# Altium project BISS_EB.PrjPcb
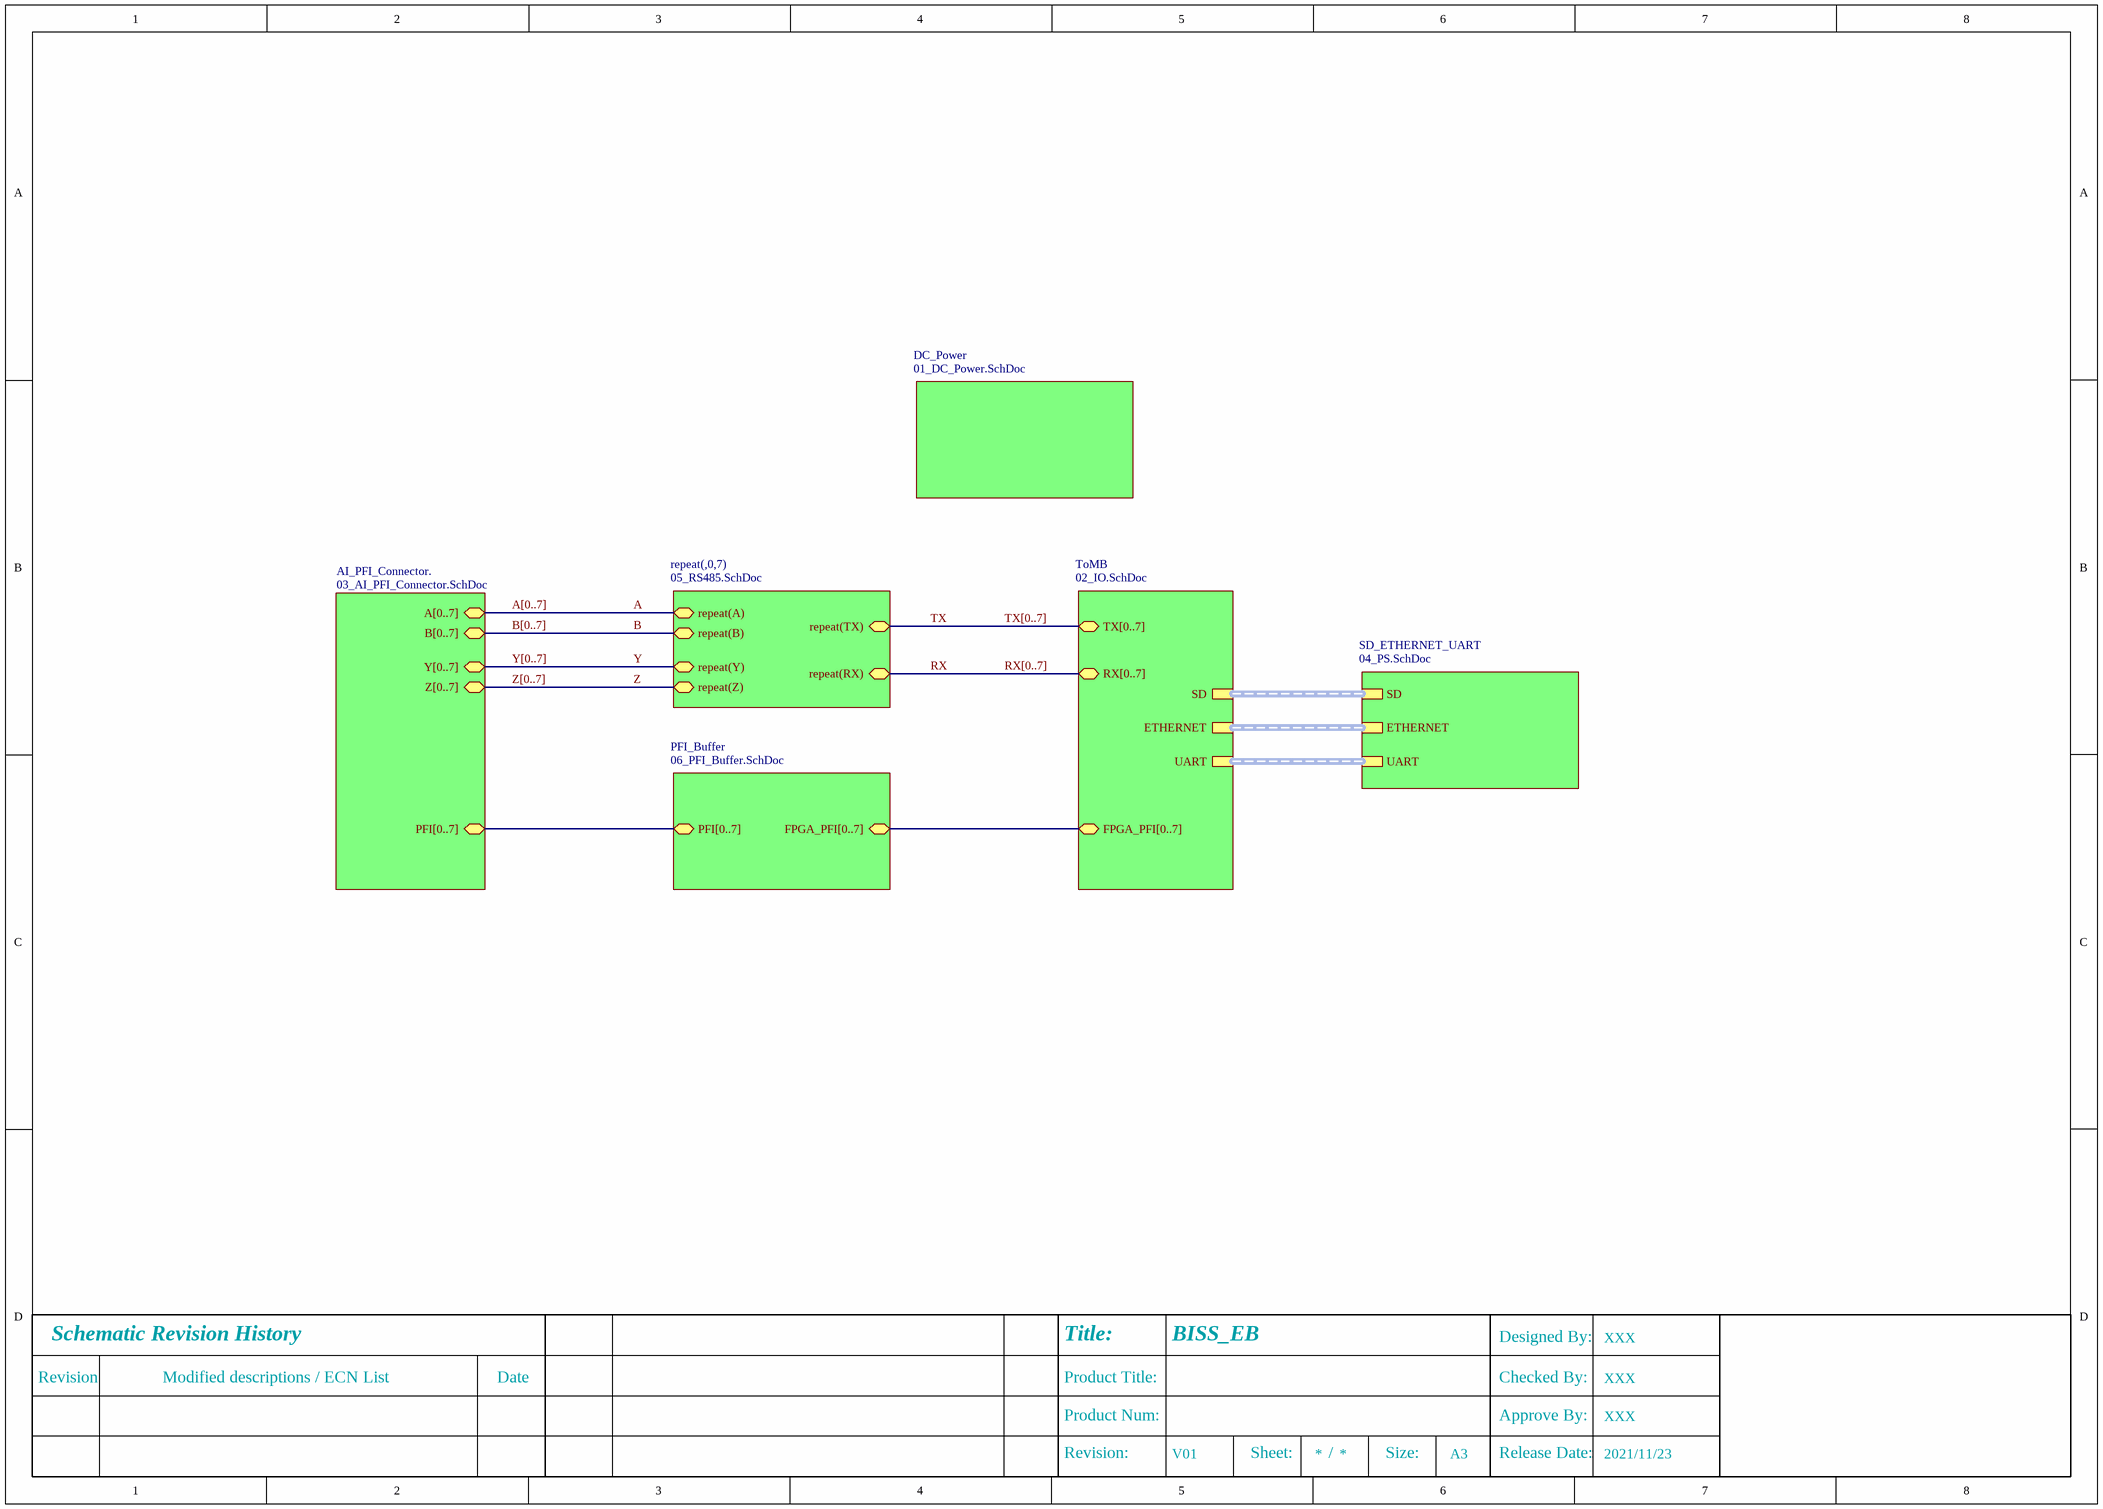
[diagram p0: 0_System.SchDoc]
PCB APP by: XXX; PCB APP Date: 2021/11/23; PCB CHK by: XXX; PCB DWG by: XXX; PCB DWG Date: 2021/11/23; PCB P/N: XXXXXXXXX; PCB REV: V01; PCB Title: Expansion_Board; Project Number: xxxxxxxx; Project Title: Expansion_Board Project; SCH_Title: BISS_EB; SCH APP by: XXX; SCH Approved Date: 2021/11/23; SCH Checked date: 2021/11/23; SCH CHK by: XXX; SCH Designed by: XXX; SCH Designed Date: 2021/11/23; SCH REV: V01
7 sheets, 195 parts. Net scope: hierarchical (ports join the sheet entries above them; power ports are global).
Board file: BISS_EB.PcbDoc
Sheets:
  0_System.SchDoc
    DC_Power = 01_DC_Power.SchDoc
    AI_PFI_Connector. = 03_AI_PFI_Connector.SchDoc
    PFI_Buffer = 06_PFI_Buffer.SchDoc
    0 = 05_RS485.SchDoc
    1 = 05_RS485.SchDoc
    2 = 05_RS485.SchDoc
    3 = 05_RS485.SchDoc
    4 = 05_RS485.SchDoc
    5 = 05_RS485.SchDoc
    6 = 05_RS485.SchDoc
    7 = 05_RS485.SchDoc
    ToMB = 02_IO.SchDoc
    SD_ETHERNET_UART = 04_PS.SchDoc

## Sheet 0_System.SchDoc
size A3

### Sub-sheets
AI_PFI_Connector. = 03_AI_PFI_Connector.SchDoc: Y[0..7] (bidir), Z[0..7] (bidir), PFI[0..7] (bidir), B[0..7] (bidir), A[0..7] (bidir)
DC_Power = 01_DC_Power.SchDoc: no entries
PFI_Buffer = 06_PFI_Buffer.SchDoc: PFI[0..7] (bidir), FPGA_PFI[0..7] (bidir)
repeat(,0,7) = 05_RS485.SchDoc: repeat(TX) (bidir), repeat(Z) (bidir), repeat(A) (bidir), repeat(B) (bidir), repeat(RX) (bidir), repeat(Y) (bidir)
SD_ETHERNET_UART = 04_PS.SchDoc: ETHERNET (harness ETHERNET), SD (harness SD), UART (harness UART)
ToMB = 02_IO.SchDoc: FPGA_PFI[0..7] (bidir), TX[0..7] (bidir), RX[0..7] (bidir), SD (harness SD), UART (harness UART), ETHERNET (harness ETHERNET)

### Nets
A: sheet repeat(,0,7)/repeat(A)
B: sheet repeat(,0,7)/repeat(B)
RX: sheet repeat(,0,7)/repeat(RX)
TX: sheet repeat(,0,7)/repeat(TX)
Y: sheet repeat(,0,7)/repeat(Y)
Z: sheet repeat(,0,7)/repeat(Z)

### Buses and harness runs
bus A[0..7] = sheet AI_PFI_Connector./A[0..7]
bus B[0..7] = sheet AI_PFI_Connector./B[0..7]
bus RX[0..7] = sheet ToMB/RX[0..7]
bus sheet AI_PFI_Connector./PFI[0..7] = sheet PFI_Buffer/PFI[0..7]
bus sheet PFI_Buffer/FPGA_PFI[0..7] = sheet ToMB/FPGA_PFI[0..7]
bus TX[0..7] = sheet ToMB/TX[0..7]
bus Y[0..7] = sheet AI_PFI_Connector./Y[0..7]
bus Z[0..7] = sheet AI_PFI_Connector./Z[0..7]
harness sheet SD_ETHERNET_UART/ETHERNET = sheet ToMB/ETHERNET
harness sheet SD_ETHERNET_UART/SD = sheet ToMB/SD
harness sheet SD_ETHERNET_UART/UART = sheet ToMB/UART

### Notes on the sheet
- Revision
- Schematic Revision History
- Modified descriptions / ECN List
- Date
- Product Title:
- Title:
- Checked By:
- Designed By:
- Revision:
- Product Num:
- Sheet:
- /
- Size:
- A3
- Approve By:
- Release Date:
- Title
- Date:
- Number:
- Time:
- Sheet
- of
- File:

## Sheet 01_DC_Power.SchDoc
size A3
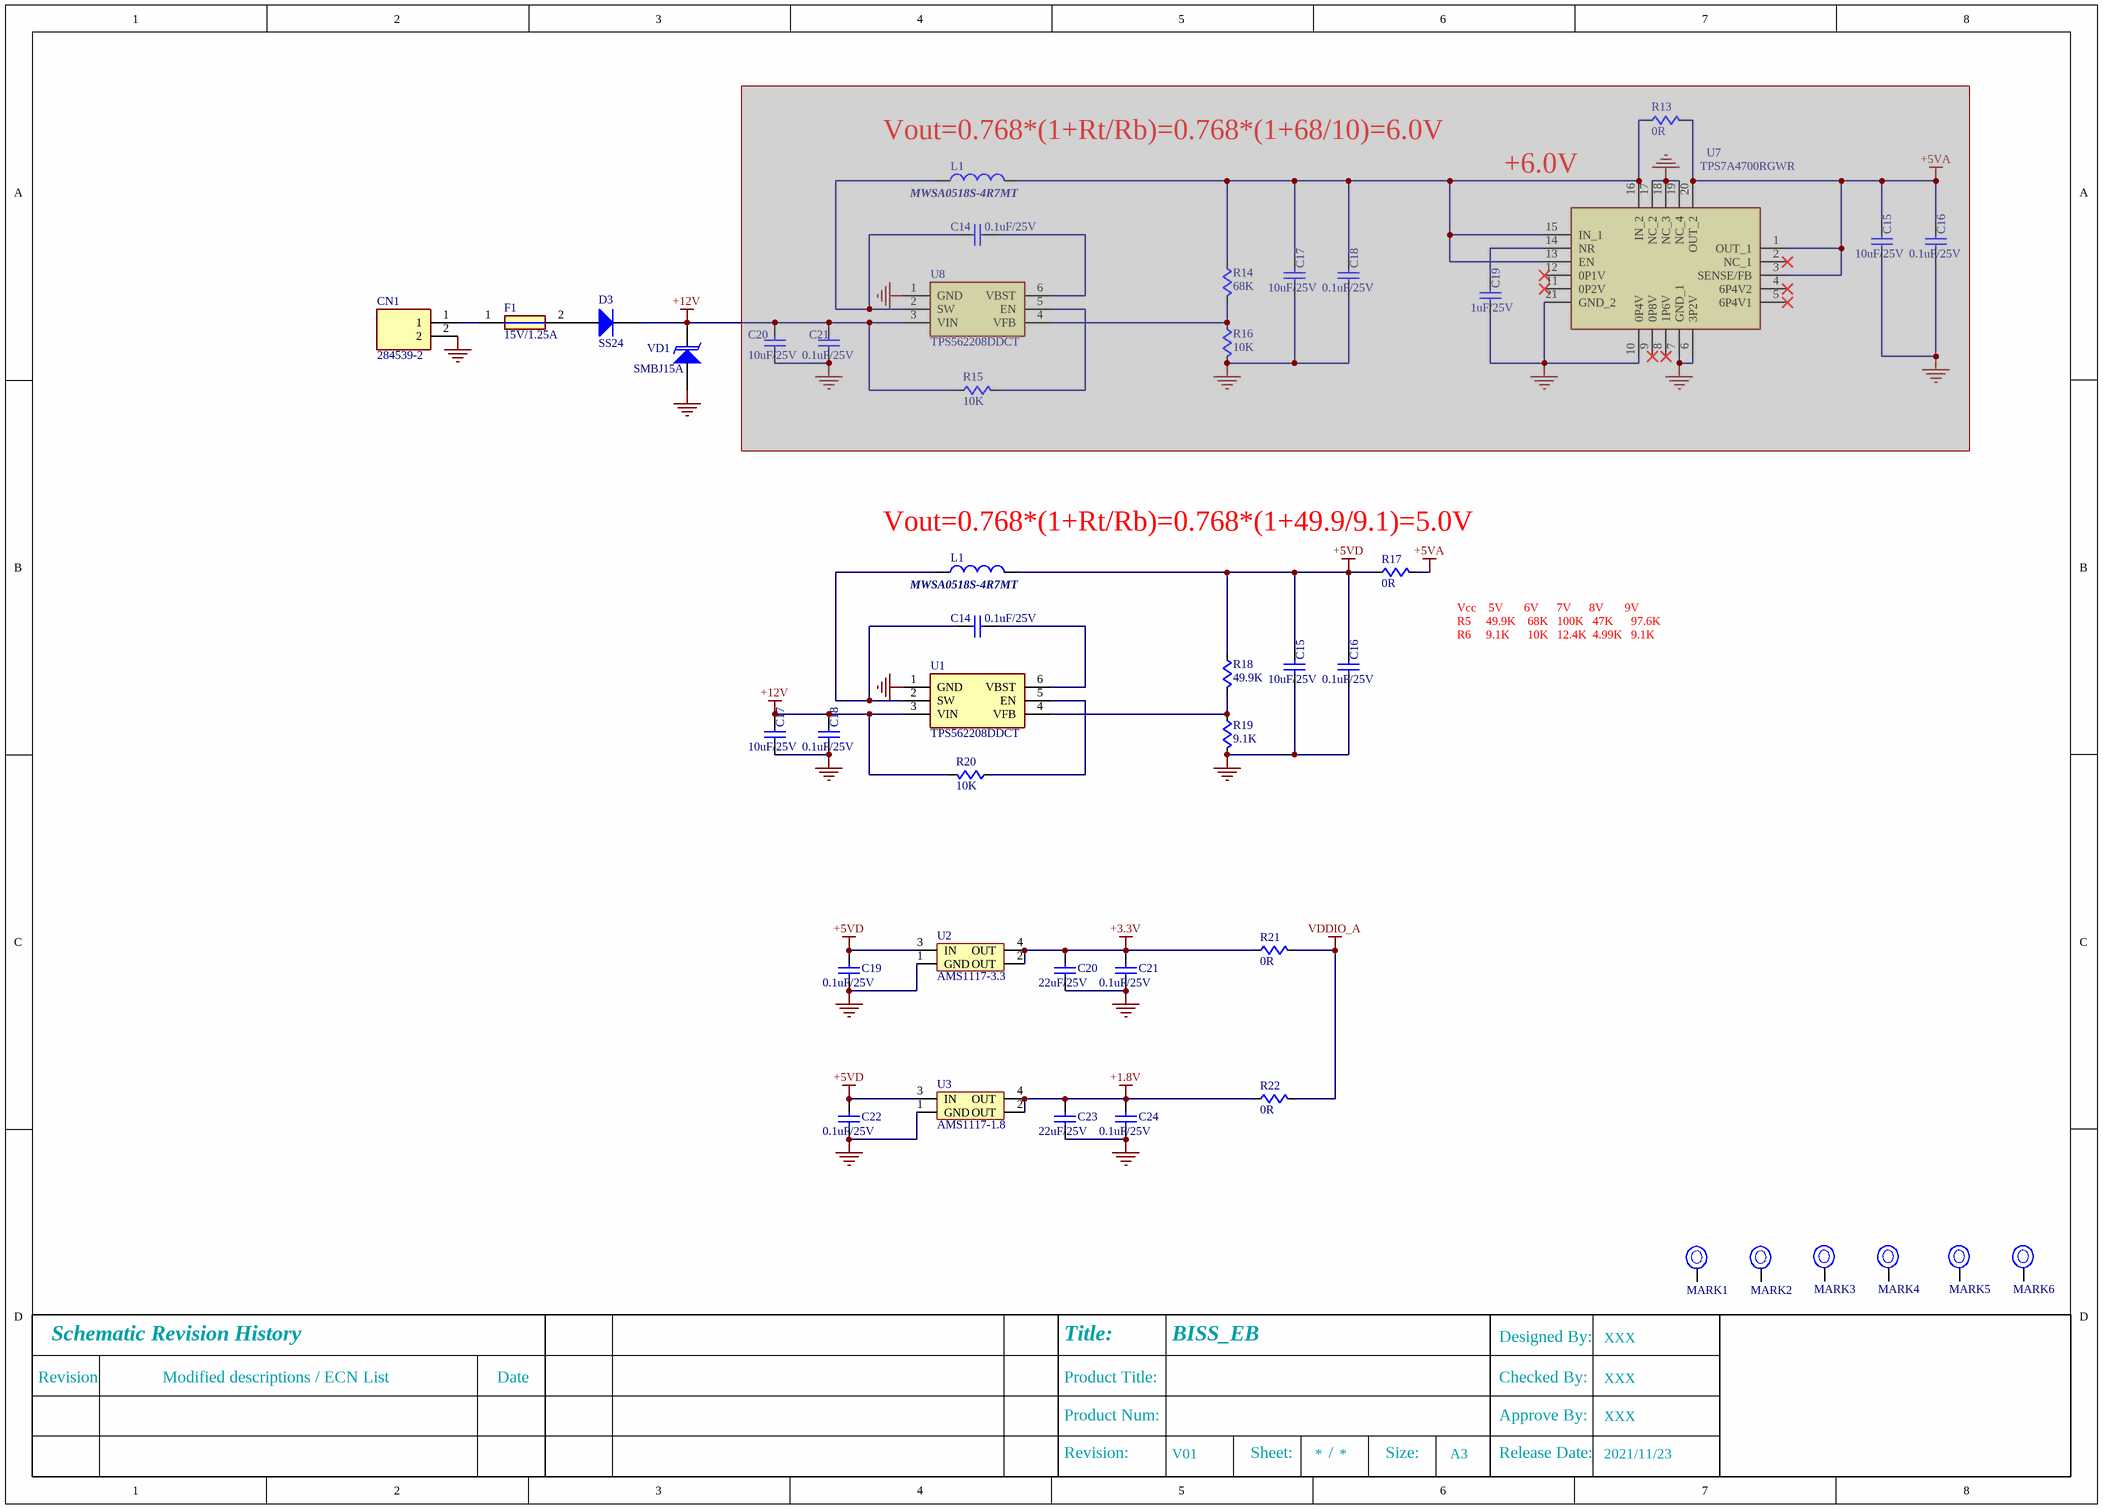
[diagram p1: 01_DC_Power.SchDoc]

### Parts
(Parts that share a designator on the sheet are numbered #1, #2 ... from top to bottom, then left to right.)
C14#1  0.1uF/25V  [C0603]  (masked out: inside a compile mask, not in the netlist)
C14#2  0.1uF/25V  [C0603]
C15#1  10uF/25V  [C1206]  (masked out: inside a compile mask, not in the netlist)
C15#2  10uF/25V  [C1206]
C16#1  0.1uF/25V  [C0603]  (masked out: inside a compile mask, not in the netlist)
C16#2  0.1uF/25V  [C0603]
C17#1  10uF/25V  [C1206]  (masked out: inside a compile mask, not in the netlist)
C17#2  10uF/25V  [C1206]
C18#1  0.1uF/25V  [C0603]  (masked out: inside a compile mask, not in the netlist)
C18#2  0.1uF/25V  [C0603]
C19#1  1uF/25V  [C0603]  (masked out: inside a compile mask, not in the netlist)
C19#2  0.1uF/25V  [C0603]
C20#1  10uF/25V  [C1206]  (masked out: inside a compile mask, not in the netlist)
C20#2  22uF/25V  [C1210]
C21#1  0.1uF/25V  [C0603]  (masked out: inside a compile mask, not in the netlist)
C21#2  0.1uF/25V  [C0603]
C22  0.1uF/25V  [C0603]
C23  22uF/25V  [C1210]
C24  0.1uF/25V  [C0603]
CN1  284539-2  [2845392]
D3  SS24  [SMB]
F1  15V/1.25A  [FUSC7451X100N]
L1#1  MWSA0518S-4R7MT  [MWSA0518S]  (masked out: inside a compile mask, not in the netlist)
L1#2  MWSA0518S-4R7MT  [MWSA0518S]
MARK1  Mark Point  [Mark point]  (value not drawn)
MARK2  Mark Point  [Mark point]  (value not drawn)
MARK3  Mark Point  [Mark point]  (value not drawn)
MARK4  Mark Point  [Mark point]  (value not drawn)
MARK5  Mark Point  [Mark point]  (value not drawn)
MARK6  Mark Point  [Mark point]  (value not drawn)
R13#1  0R  [R0805]  (masked out: inside a compile mask, not in the netlist)
R14#1  68K  [R0603]  (masked out: inside a compile mask, not in the netlist)
R15#1  10K  [R0603]  (masked out: inside a compile mask, not in the netlist)
R16#1  10K  [R0603]  (masked out: inside a compile mask, not in the netlist)
R17  0R  [R0805]
R18  49.9K  [R0603]
R19  9.1K  [R0603]
R20  10K  [R0603]
R21  0R  [R0805]
R22  0R  [R0805]
U1  TPS562208DDCT  [SOT95P280X110-6N]
U2  AMS1117-3.3  [AMS1117]
U3  AMS1117-1.8  [AMS1117]
U7#1  TPS7A4700RGWR  [QFN65P500X500X100-21N-D]  (masked out: inside a compile mask, not in the netlist)
U8#1  TPS562208DDCT  [SOT95P280X110-6N]  (masked out: inside a compile mask, not in the netlist)
VD1  SMBJ15A  [SMB]

### Nets
+1.8V: C23.2 C24.2 R22.1 U3.2(OUT) U3.4(OUT)
+3.3V: C20#2.2 C21#2.2 R21.1 U2.2(OUT) U2.4(OUT)
+5VA: R17.2
+5VD: C15#2.1 C16#2.1 C19#2.2 C22.2 L1#2.1 R17.1 R18.1 U2.3(IN) U3.3(IN)
+12V: C17#2.1 C18#2.1 D3.2(K) R20.2 U1.3(VIN) VD1.2(K)
GND: C15#2.2 C16#2.2 C17#2.2 C18#2.2 C19#2.1 C20#2.1 C21#2.1 C22.1 C23.1 C24.1 CN1.2 R19.2 U1.1(GND) U2.1(GND) U3.1(GND) VD1.1(A)
VDDIO_A: R21.2 R22.2
NetC14#2_1: C14#2.1 L1#2.2 U1.2(SW)
NetC14#2_2: C14#2.2 U1.6(VBST)
NetCN1_1: CN1.1 F1.1
NetD3_1: D3.1(A) F1.2
NetR18_2: R18.2 R19.1 U1.4(VFB)
NetR20_1: R20.1 U1.5(EN)

Not connected (* = marked no-connect by the designer): MARK1 1; MARK2 1; MARK3 1; MARK4 1; MARK5 1; MARK6 1

### Notes on the sheet
- (near L1#1) Vout=0.768*(1+Rt/Rb)=0.768*(1+68/10)=6.0V
- (near U7#1) +6.0V
- Vout=0.768*(1+Rt/Rb)=0.768*(1+49.9/9.1)=5.0V
- Vcc    5V       6V      7V      8V       9V
  R5     49.9K    68K   100K   47K      97.6K
  R6     9.1K      10K   12.4K  4.99K   9.1K
- Revision
- Schematic Revision History
- Modified descriptions / ECN List
- Date
- Product Title:
- Title:
- Checked By:
- Designed By:
- Revision:
- Product Num:
- Sheet:
- /
- Size:
- A3
- Approve By:
- Release Date:
- Title
- Date:
- Number:
- Time:
- Sheet
- of
- File:

### Library data of the parts
C14#1 C14#2 C15#1 C15#2 C16#1 C16#2 C17#1 C17#2 C18#1 C18#2 C19#1 C19#2 C20#1 C20#2 C21#1 C21#2 C22-C24 = C: MLCC
CN1 = 284539-2: Connector; Manufacturer_Name: TE Connectivity; Datasheet Link: http://www.te.com/commerce/DocumentDelivery/DDEController?Action=showdoc&DocId=Customer+Drawing%7F284539%7FB1%7Fpdf%7FEnglish%7FENG_CD_284539_B1.pdf%7F284539-2; Height: 7.4mm; Manufacturer_Part_Number: 284539-2; Mouser Part Number: 571-284539-2; Mouser Price/Stock: https://www.mouser.co.uk/ProductDetail/TE-Connectivity/284539-2?qs=lyRJTFulC0ZdkPBib8mRwg%3D%3D; Arrow Part Number: 284539-2; Arrow Price/Stock: https://www.arrow.com/en/products/284539-2/te-connectivity?region=nac
D3 = Diode(SMD): 二极管; U_TABLE: U_103; 物料描述: 扬杰科技SMT快恢复管E1A
F1 = 2920L125PR: Manufacturer_Name: LITTELFUSE; Datasheet Link: https://datasheet.lcsc.com/szlcsc/1907051732_Littelfuse-2920L125PR_C192524.pdf; Height: 1mm; Manufacturer_Part_Number: 2920L125PR; Mouser Part Number: 576-2920L125; Mouser Price/Stock: https://www.mouser.co.uk/ProductDetail/Littelfuse/2920L125PR?qs=SJZ%252BTX%252BI2BSHRP6GPsgTlw%3D%3D; Arrow Part Number: 2920L125PR; Arrow Price/Stock: https://www.arrow.com/en/products/2920l125pr/littelfuse?region=nac
L1#1 L1#2 = 3015/22uH/0.6A: 贴片电感器，顺络; 1-物料编码: 160701546; 1-物料描述: SMT电感SPH4018H150MT_15uH_顺络_EHRA; 物料品名: 贴片电感; 物料优选等级: 无
R13#1 R14#1 R15#1 R16#1 R17-R22 = R: 贴片电阻
U1 U8#1 = TPS562208DDCT: Integrated Circuit; Manufacturer_Name: Texas Instruments; Datasheet Link: http://www.ti.com/lit/gpn/TPS562208; Height: 1.1mm; Manufacturer_Part_Number: TPS562208DDCT; Mouser Part Number: 595-TPS562208DDCT; Mouser Price/Stock: https://www.mouser.co.uk/ProductDetail/Texas-Instruments/TPS562208DDCT?qs=G55MHhPmvtKSn8TVxo8Xvw%3D%3D; Arrow Part Number: TPS562208DDCT; Arrow Price/Stock: https://www.arrow.com/en/products/tps562208ddct/texas-instruments
U2 U3 = AMS1117: AMS公司，SOT-223
U7#1 = TPS7A4700RGWR: Integrated Circuit; Manufacturer_Name: Texas Instruments; Datasheet Link: http://www.ti.com/lit/gpn/tps7a47; Height: 1mm; Manufacturer_Part_Number: TPS7A4700RGWR; Mouser Part Number: 595-TPS7A4700RGWR; Mouser Price/Stock: https://www.mouser.co.uk/ProductDetail/Texas-Instruments/TPS7A4700RGWR?qs=b5Ofe9I6AaEq0TfoG6v9lA%3D%3D; Arrow Part Number: TPS7A4700RGWR; Arrow Price/Stock: https://www.arrow.com/en/products/tps7a4700rgwr/texas-instruments?region=nac
VD1 = Diode(TVS): TVS管; U_TABLE: U_103

## Sheet 03_AI_PFI_Connector.SchDoc
size A3
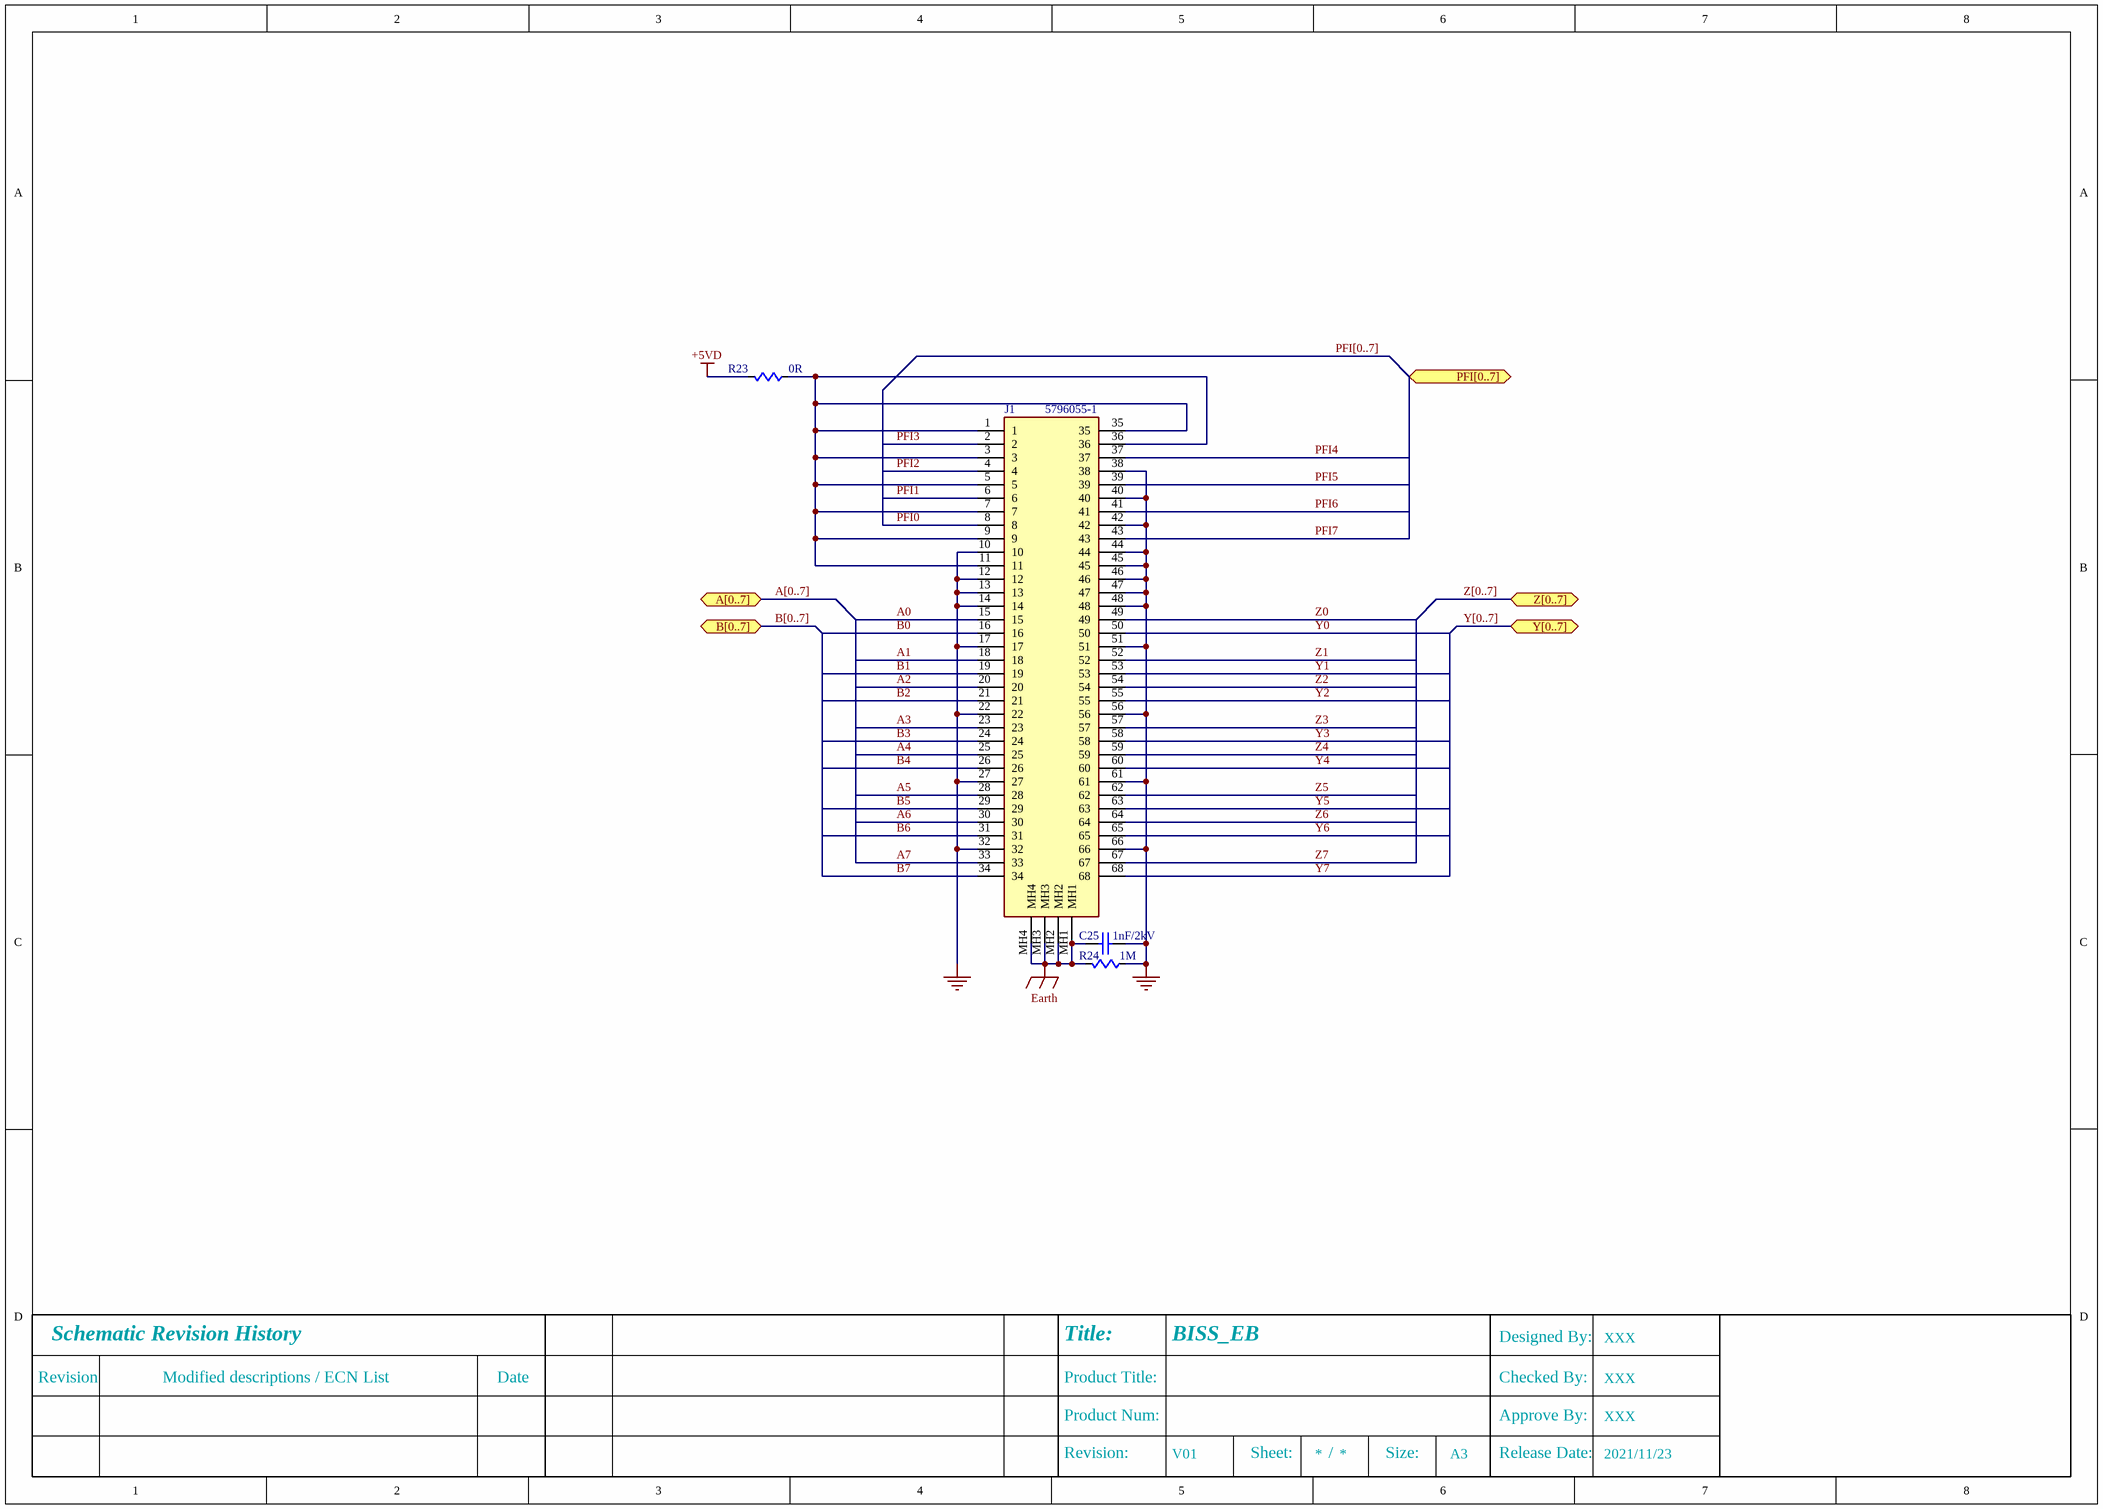
[diagram p2: 03_AI_PFI_Connector.SchDoc]

### Parts
C25  1nF/2kV  [C1206]
J1  5796055-1  [57960551]
R23  0R  [R0805]
R24  1M  [R1206]

### Ports
A[0..7] (bidir), B[0..7] (bidir), PFI[0..7] (bidir), Y[0..7] (bidir), Z[0..7] (bidir)

### Nets
+5VD: R23.2
Earth: C25.1 J1.MH1 J1.MH2 J1.MH3 J1.MH4 R24.1
GND: C25.2 J1.10 J1.12 J1.13 J1.14 J1.17 J1.22 J1.27 J1.32 J1.38 J1.40 J1.42 J1.44 J1.45 J1.46 J1.47 J1.48 J1.51 J1.56 J1.61 J1.66 R24.2
A0: J1.15  [project net A]
A1: J1.18  [project net A]
A2: J1.20  [project net A]
A3: J1.23  [project net A]
A4: J1.25  [project net A]
A5: J1.28  [project net A]
A6: J1.30  [project net A]
A7: J1.33  [project net A]
B0: J1.16  [project net B]
B1: J1.19  [project net B]
B2: J1.21  [project net B]
B3: J1.24  [project net B]
B4: J1.26  [project net B]
B5: J1.29  [project net B]
B6: J1.31  [project net B]
B7: J1.34  [project net B]
PFI0: J1.8
PFI1: J1.6
PFI2: J1.4
PFI3: J1.2
PFI4: J1.37
PFI5: J1.39
PFI6: J1.41
PFI7: J1.43
Y0: J1.50  [project net Y]
Y1: J1.53  [project net Y]
Y2: J1.55  [project net Y]
Y3: J1.58  [project net Y]
Y4: J1.60  [project net Y]
Y5: J1.63  [project net Y]
Y6: J1.65  [project net Y]
Y7: J1.68  [project net Y]
Z0: J1.49  [project net Z]
Z1: J1.52  [project net Z]
Z2: J1.54  [project net Z]
Z3: J1.57  [project net Z]
Z4: J1.59  [project net Z]
Z5: J1.62  [project net Z]
Z6: J1.64  [project net Z]
Z7: J1.67  [project net Z]
NetJ1_1: J1.1 J1.3 J1.5 J1.7 J1.9 J1.11 J1.35 J1.36 R23.1

### Buses and harness runs
bus A[0..7] = port A[0..7]
bus B[0..7] = port B[0..7]
bus PFI[0..7] = port PFI[0..7]
bus Y[0..7] = port Y[0..7]
bus Z[0..7] = port Z[0..7]

### Notes on the sheet
- Revision
- Schematic Revision History
- Modified descriptions / ECN List
- Date
- Product Title:
- Title:
- Checked By:
- Designed By:
- Revision:
- Product Num:
- Sheet:
- /
- Size:
- A3
- Approve By:
- Release Date:
- Title
- Date:
- Number:
- Time:
- Sheet
- of
- File:

### Library data of the parts
C25 = C: MLCC
J1 = 5796055-1: Connector; Manufacturer_Name: TE Connectivity; Datasheet Link: https://www.te.com/commerce/DocumentDelivery/DDEController?Action=showdoc&DocId=Customer+Drawing%7F5796055%7FD1%7Fpdf%7FEnglish%7FENG_CD_5796055_D1.pdf%7F5796055-1; Height: 6.97mm; Manufacturer_Part_Number: 5796055-1; Mouser Part Number: 571-5796055-1; Mouser Price/Stock: https://www.mouser.co.uk/ProductDetail/TE-Connectivity/5796055-1?qs=PmjM%2FwY1RTotsIMTk9j%2Fug%3D%3D; Arrow Part Number: 5796055-1; Arrow Price/Stock: https://www.arrow.com/en/products/5796055-1/te-connectivity?region=nac
R23 = R: 贴片电阻
R24 = R: 贴片电阻 1206

## Sheet 06_PFI_Buffer.SchDoc
size A3
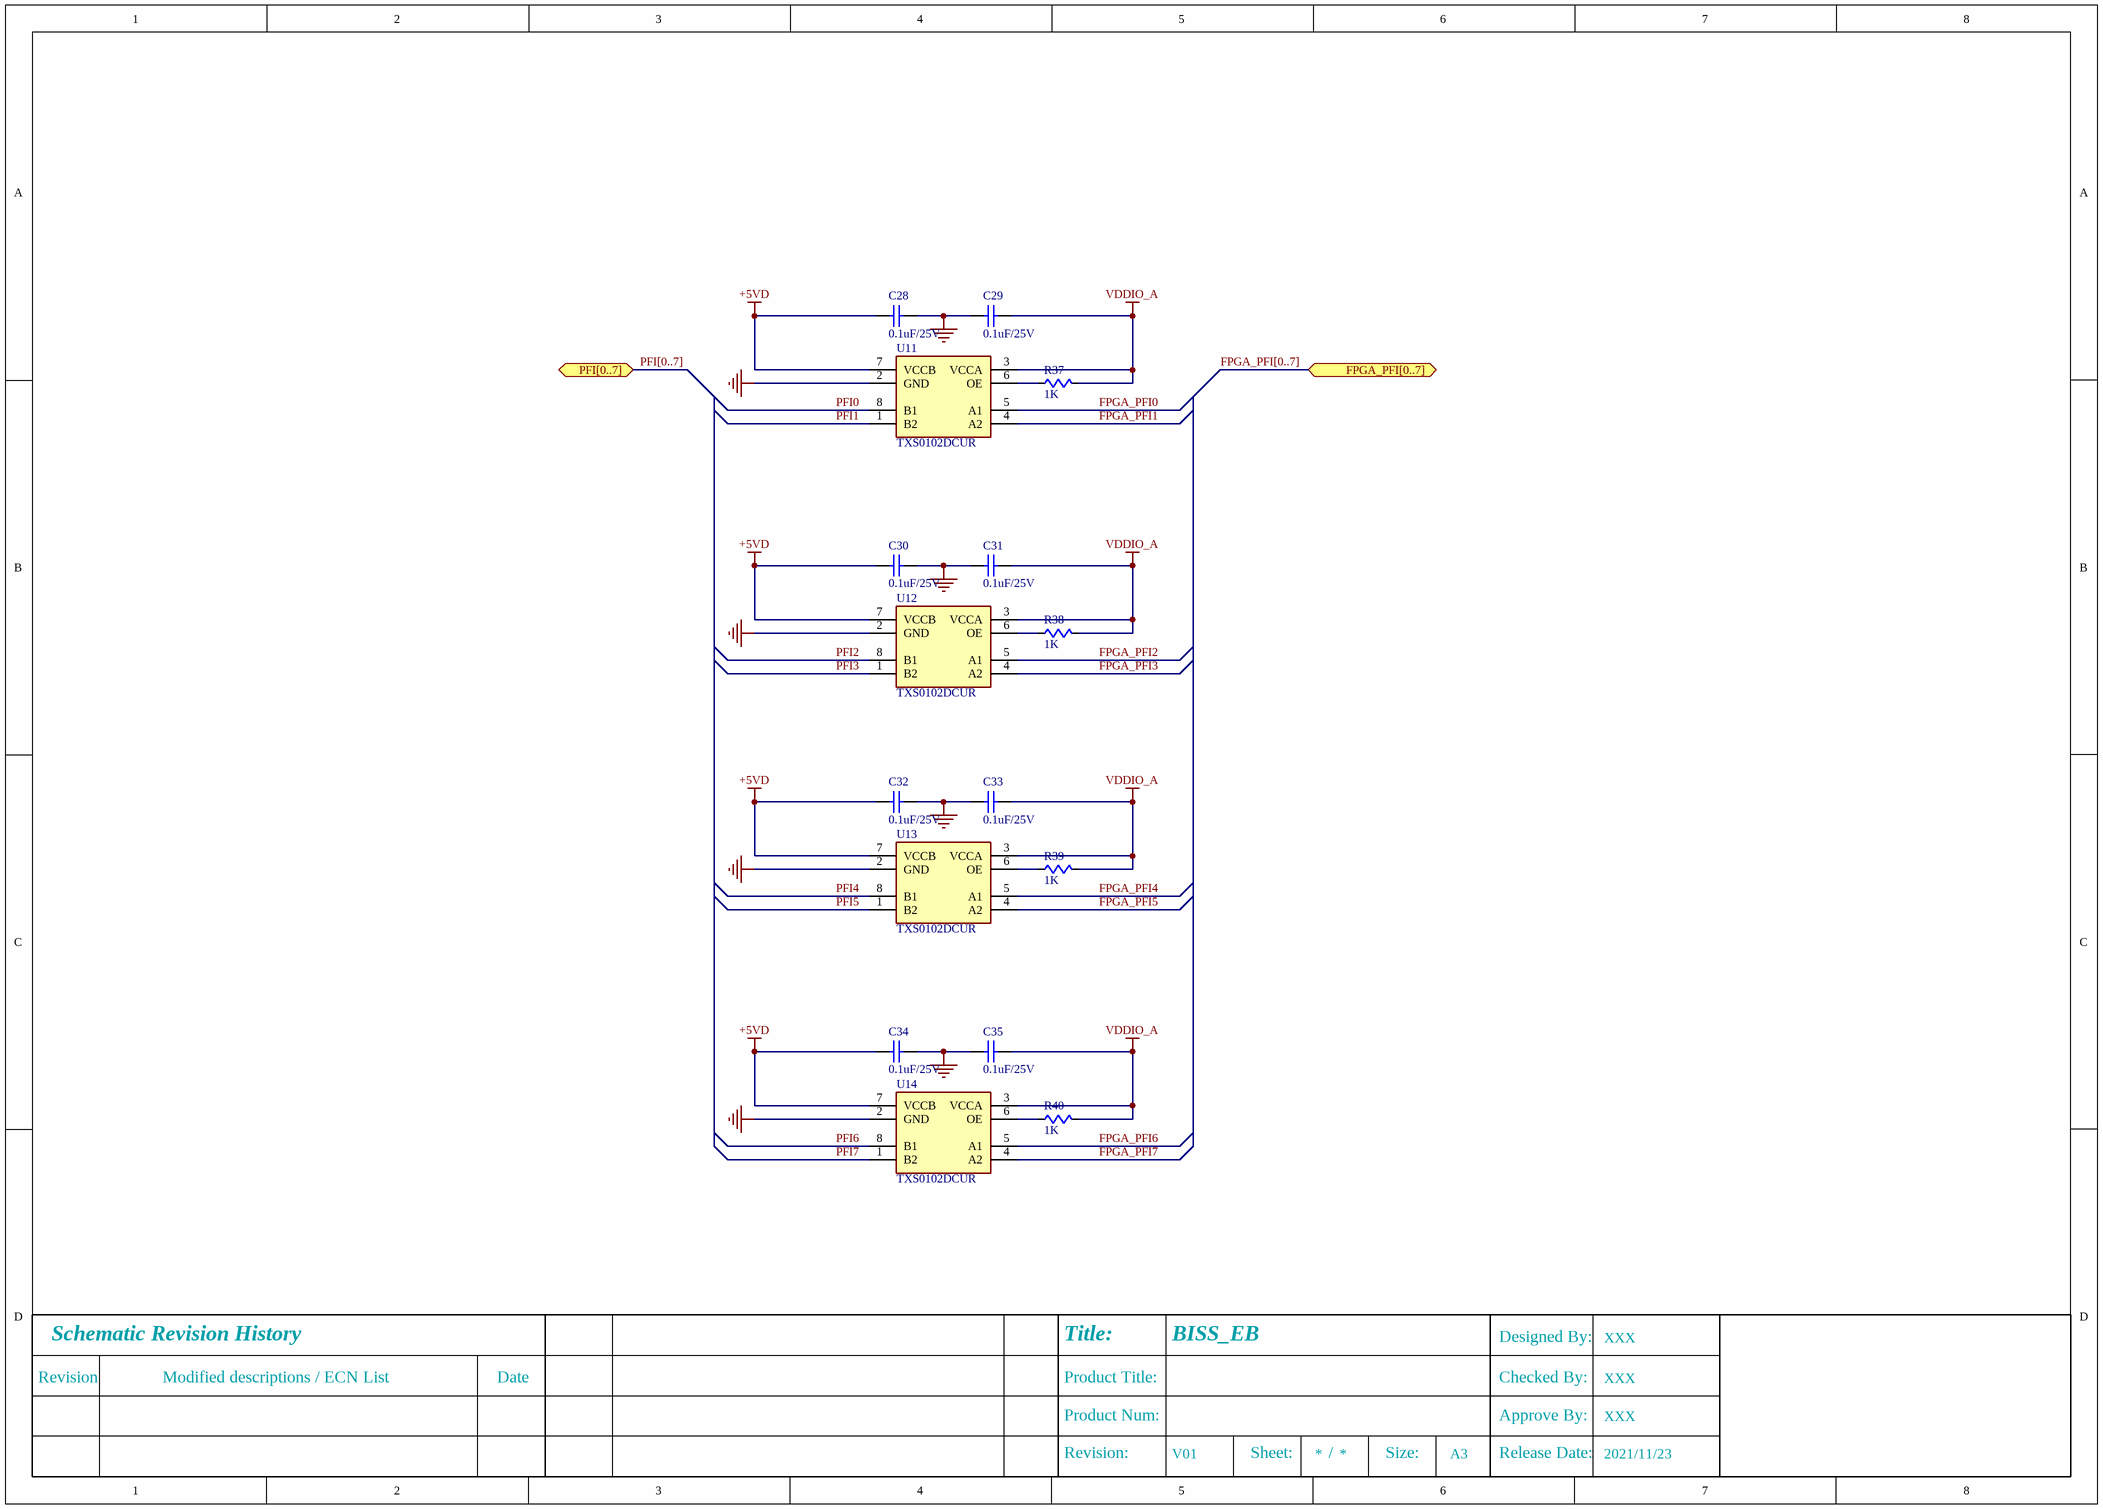
[diagram p3: 06_PFI_Buffer.SchDoc]

### Parts
C28  0.1uF/25V  [C0603]
C29  0.1uF/25V  [C0603]
C30  0.1uF/25V  [C0603]
C31  0.1uF/25V  [C0603]
C32  0.1uF/25V  [C0603]
C33  0.1uF/25V  [C0603]
C34  0.1uF/25V  [C0603]
C35  0.1uF/25V  [C0603]
R37  1K  [R0603]
R38  1K  [R0603]
R39  1K  [R0603]
R40  1K  [R0603]
U11  TXS0102DCUR  [SOP50P310X90-8N]
U12  TXS0102DCUR  [SOP50P310X90-8N]
U13  TXS0102DCUR  [SOP50P310X90-8N]
U14  TXS0102DCUR  [SOP50P310X90-8N]

### Ports
FPGA_PFI[0..7] (bidir), PFI[0..7] (bidir)

### Nets
+5VD: C28.1 C30.1 C32.1 C34.1 U11.7(VCCB) U12.7(VCCB) U13.7(VCCB) U14.7(VCCB)
GND: C28.2 C29.1 C30.2 C31.1 C32.2 C33.1 C34.2 C35.1 U11.2(GND) U12.2(GND) U13.2(GND) U14.2(GND)
VDDIO_A: C29.2 C31.2 C33.2 C35.2 R37.2 R38.2 R39.2 R40.2 U11.3(VCCA) U12.3(VCCA) U13.3(VCCA) U14.3(VCCA)
FPGA_PFI0: U11.5(A1)  [project net B35_L17_N]
FPGA_PFI1: U11.4(A2)  [project net B35_L17_P]
FPGA_PFI2: U12.5(A1)  [project net B35_L10_N]
FPGA_PFI3: U12.4(A2)  [project net B35_L10_P]
FPGA_PFI4: U13.5(A1)  [project net B35_L18_N]
FPGA_PFI5: U13.4(A2)  [project net B35_L18_P]
FPGA_PFI6: U14.5(A1)  [project net B35_L14_N]
FPGA_PFI7: U14.4(A2)  [project net B35_L14_P]
PFI0: U11.8(B1)
PFI1: U11.1(B2)
PFI2: U12.8(B1)
PFI3: U12.1(B2)
PFI4: U13.8(B1)
PFI5: U13.1(B2)
PFI6: U14.8(B1)
PFI7: U14.1(B2)
NetR37_1: R37.1 U11.6(OE)
NetR38_1: R38.1 U12.6(OE)
NetR39_1: R39.1 U13.6(OE)
NetR40_1: R40.1 U14.6(OE)

### Buses and harness runs
bus FPGA_PFI[0..7] = port FPGA_PFI[0..7]
bus PFI[0..7] = port PFI[0..7]

### Notes on the sheet
- Revision
- Schematic Revision History
- Modified descriptions / ECN List
- Date
- Product Title:
- Title:
- Checked By:
- Designed By:
- Revision:
- Product Num:
- Sheet:
- /
- Size:
- A3
- Approve By:
- Release Date:
- Title
- Date:
- Number:
- Time:
- Sheet
- of
- File:

### Library data of the parts
C28-C35 = C: MLCC
R37-R40 = R: 贴片电阻
U11-U14 = TXS0102DCUR: Integrated Circuit; Manufacturer_Name: Texas Instruments; Datasheet Link: https://datasheet.datasheetarchive.com/originals/distributors/SFDatasheet-7/sf-000145437.pdf; Height: 0.9mm; Manufacturer_Part_Number: TXS0102DCUR; Mouser Part Number: 595-TXS0102DCUR; Mouser Price/Stock: https://www.mouser.co.uk/ProductDetail/Texas-Instruments/TXS0102DCUR?qs=dB0LedT%252BmmBcQ3I%2Fs9XEDA%3D%3D; Arrow Part Number: TXS0102DCUR; Arrow Price/Stock: https://www.arrow.com/en/products/txs0102dcur/texas-instruments?region=nac

## Sheet 05_RS485.SchDoc
size A3
Used 8 times, as channels 0, 1, 2, 3, 4, 5, 6, 7. Parts and nets are listed once, with the designators drawn on the sheet.
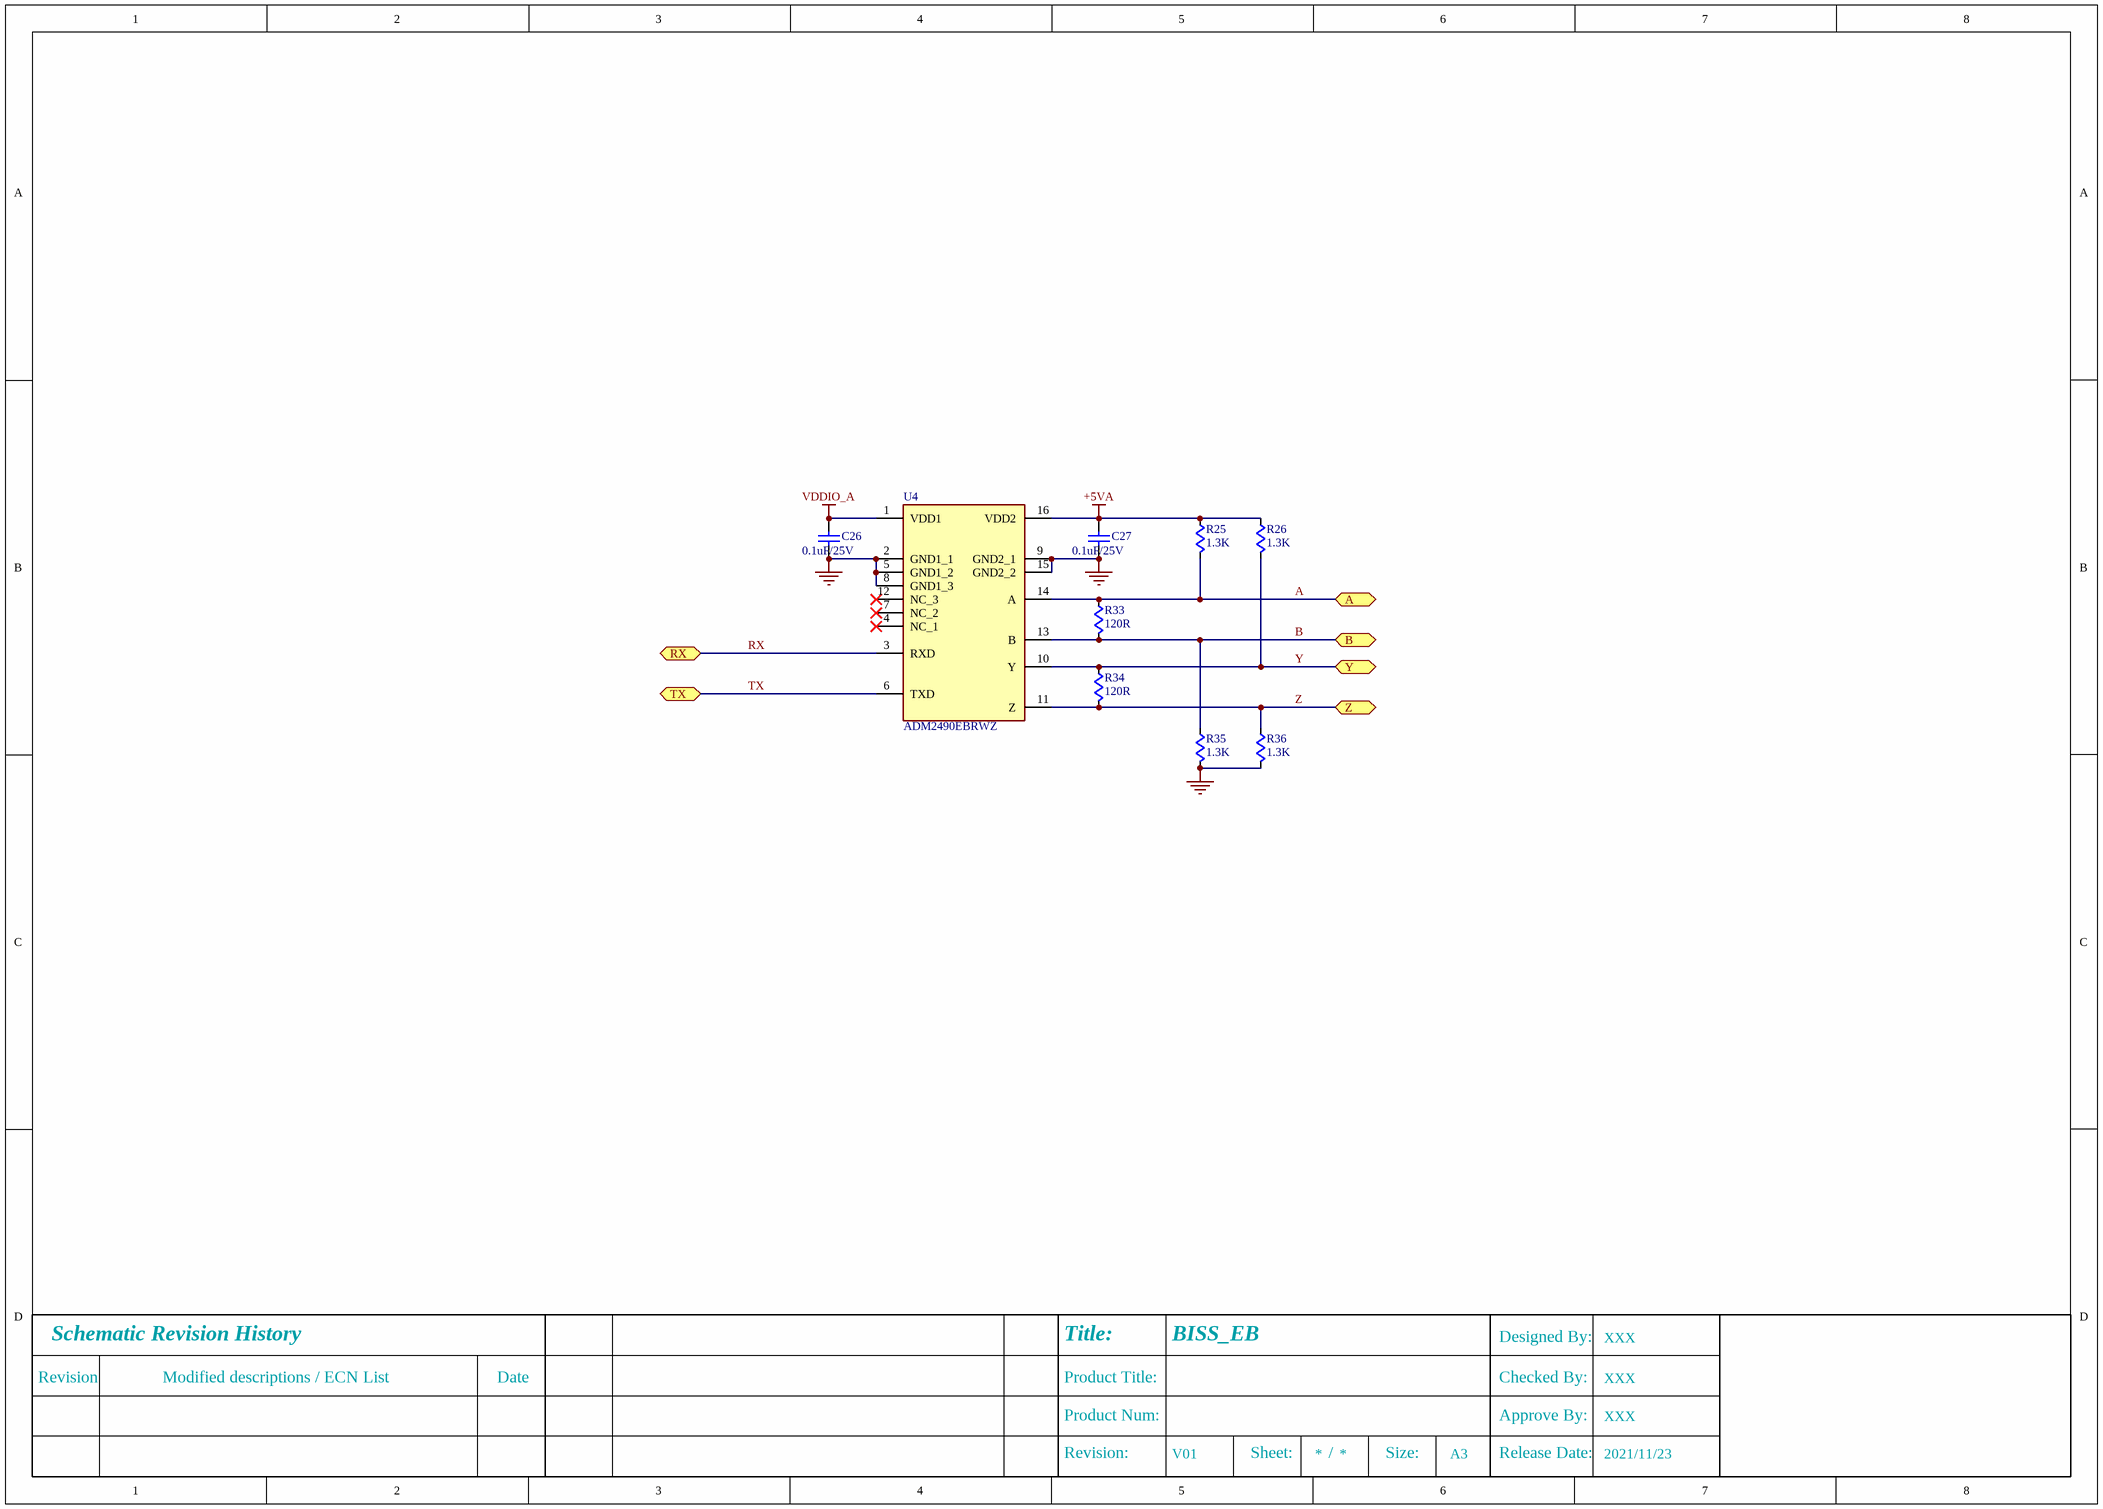
[diagram p4: 05_RS485.SchDoc]

### Parts
C26  0.1uF/25V  [C0603]
C27  0.1uF/25V  [C0603]
R25  1.3K  [R0603]
R26  1.3K  [R0603]
R33  120R  [R0603]
R34  120R  [R0603]
R35  1.3K  [R0603]
R36  1.3K  [R0603]
U4  ADM2490EBRWZ  [SOIC127P1032X265-16N]

### Ports
A (bidir), B (bidir), RX (bidir), TX (bidir), Y (bidir), Z (bidir)

### Nets
+5VA: C27.1 R25.1 R26.1 U4.16(VDD2)
GND: C26.2 C27.2 R35.2 R36.2 U4.2(GND1_1) U4.5(GND1_2) U4.8(GND1_3) U4.9(GND2_1) U4.15(GND2_2)
VDDIO_A: C26.1 U4.1(VDD1)
A: R25.2 R33.1 U4.14(A) ; port A
B: R33.2 R35.1 U4.13(B) ; port B
RX: U4.3(RXD) ; port RX
TX: U4.6(TXD) ; port TX
Y: R26.2 R34.1 U4.10(Y) ; port Y
Z: R34.2 R36.1 U4.11(Z) ; port Z

Not connected (* = marked no-connect by the designer): U4 4(NC_1)* 7(NC_2)* 12(NC_3)*

### Channels
0: designators end in _0; ports A=A B=B RX=B35_L7_N TX=B35_L7_P Y=Y Z=Z
1: designators end in _1; ports A=A B=B RX=B35_L9_P TX=B35_L9_N Y=Y Z=Z
2: designators end in _2; ports A=A B=B RX=B35_L8_N TX=B35_L8_P Y=Y Z=Z
3: designators end in _3; ports A=A B=B RX=B35_L16_N TX=B35_L16_P Y=Y Z=Z
4: designators end in _4; ports A=A B=B RX=B35_L5_N TX=B35_L5_P Y=Y Z=Z
5: designators end in _5; ports A=A B=B RX=B35_L6_N TX=B35_L6_P Y=Y Z=Z
6: designators end in _6; ports A=A B=B RX=B35_L22_N TX=B35_L22_P Y=Y Z=Z
7: designators end in _7; ports A=A B=B RX=B35_L21_N TX=B35_L21_P Y=Y Z=Z

### Notes on the sheet
- Revision
- Schematic Revision History
- Modified descriptions / ECN List
- Date
- Product Title:
- Title:
- Checked By:
- Designed By:
- Revision:
- Product Num:
- Sheet:
- /
- Size:
- A3
- Approve By:
- Release Date:
- Title
- Date:
- Number:
- Time:
- Sheet
- of
- File:

### Library data of the parts
C26 C27 = C: MLCC
R25 R26 R33-R36 = R: 贴片电阻
U4 = ADM2490EBRWZ: Integrated Circuit; Manufacturer_Name: Analog Devices; Datasheet Link: https://datasheet.datasheetarchive.com/originals/distributors/Datasheets-4/DSA-67751.pdf; Height: 2.65mm; Manufacturer_Part_Number: ADM2490EBRWZ; Mouser Part Number: 584-ADM2490EBRWZ; Mouser Price/Stock: https://www.mouser.co.uk/ProductDetail/Analog-Devices/ADM2490EBRWZ?qs=BpaRKvA4VqFSbCEyp2Yp5g%3D%3D; Arrow Part Number: ADM2490EBRWZ; Arrow Price/Stock: https://www.arrow.com/en/products/adm2490ebrwz/analog-devices

## Sheet 02_IO.SchDoc
size A3
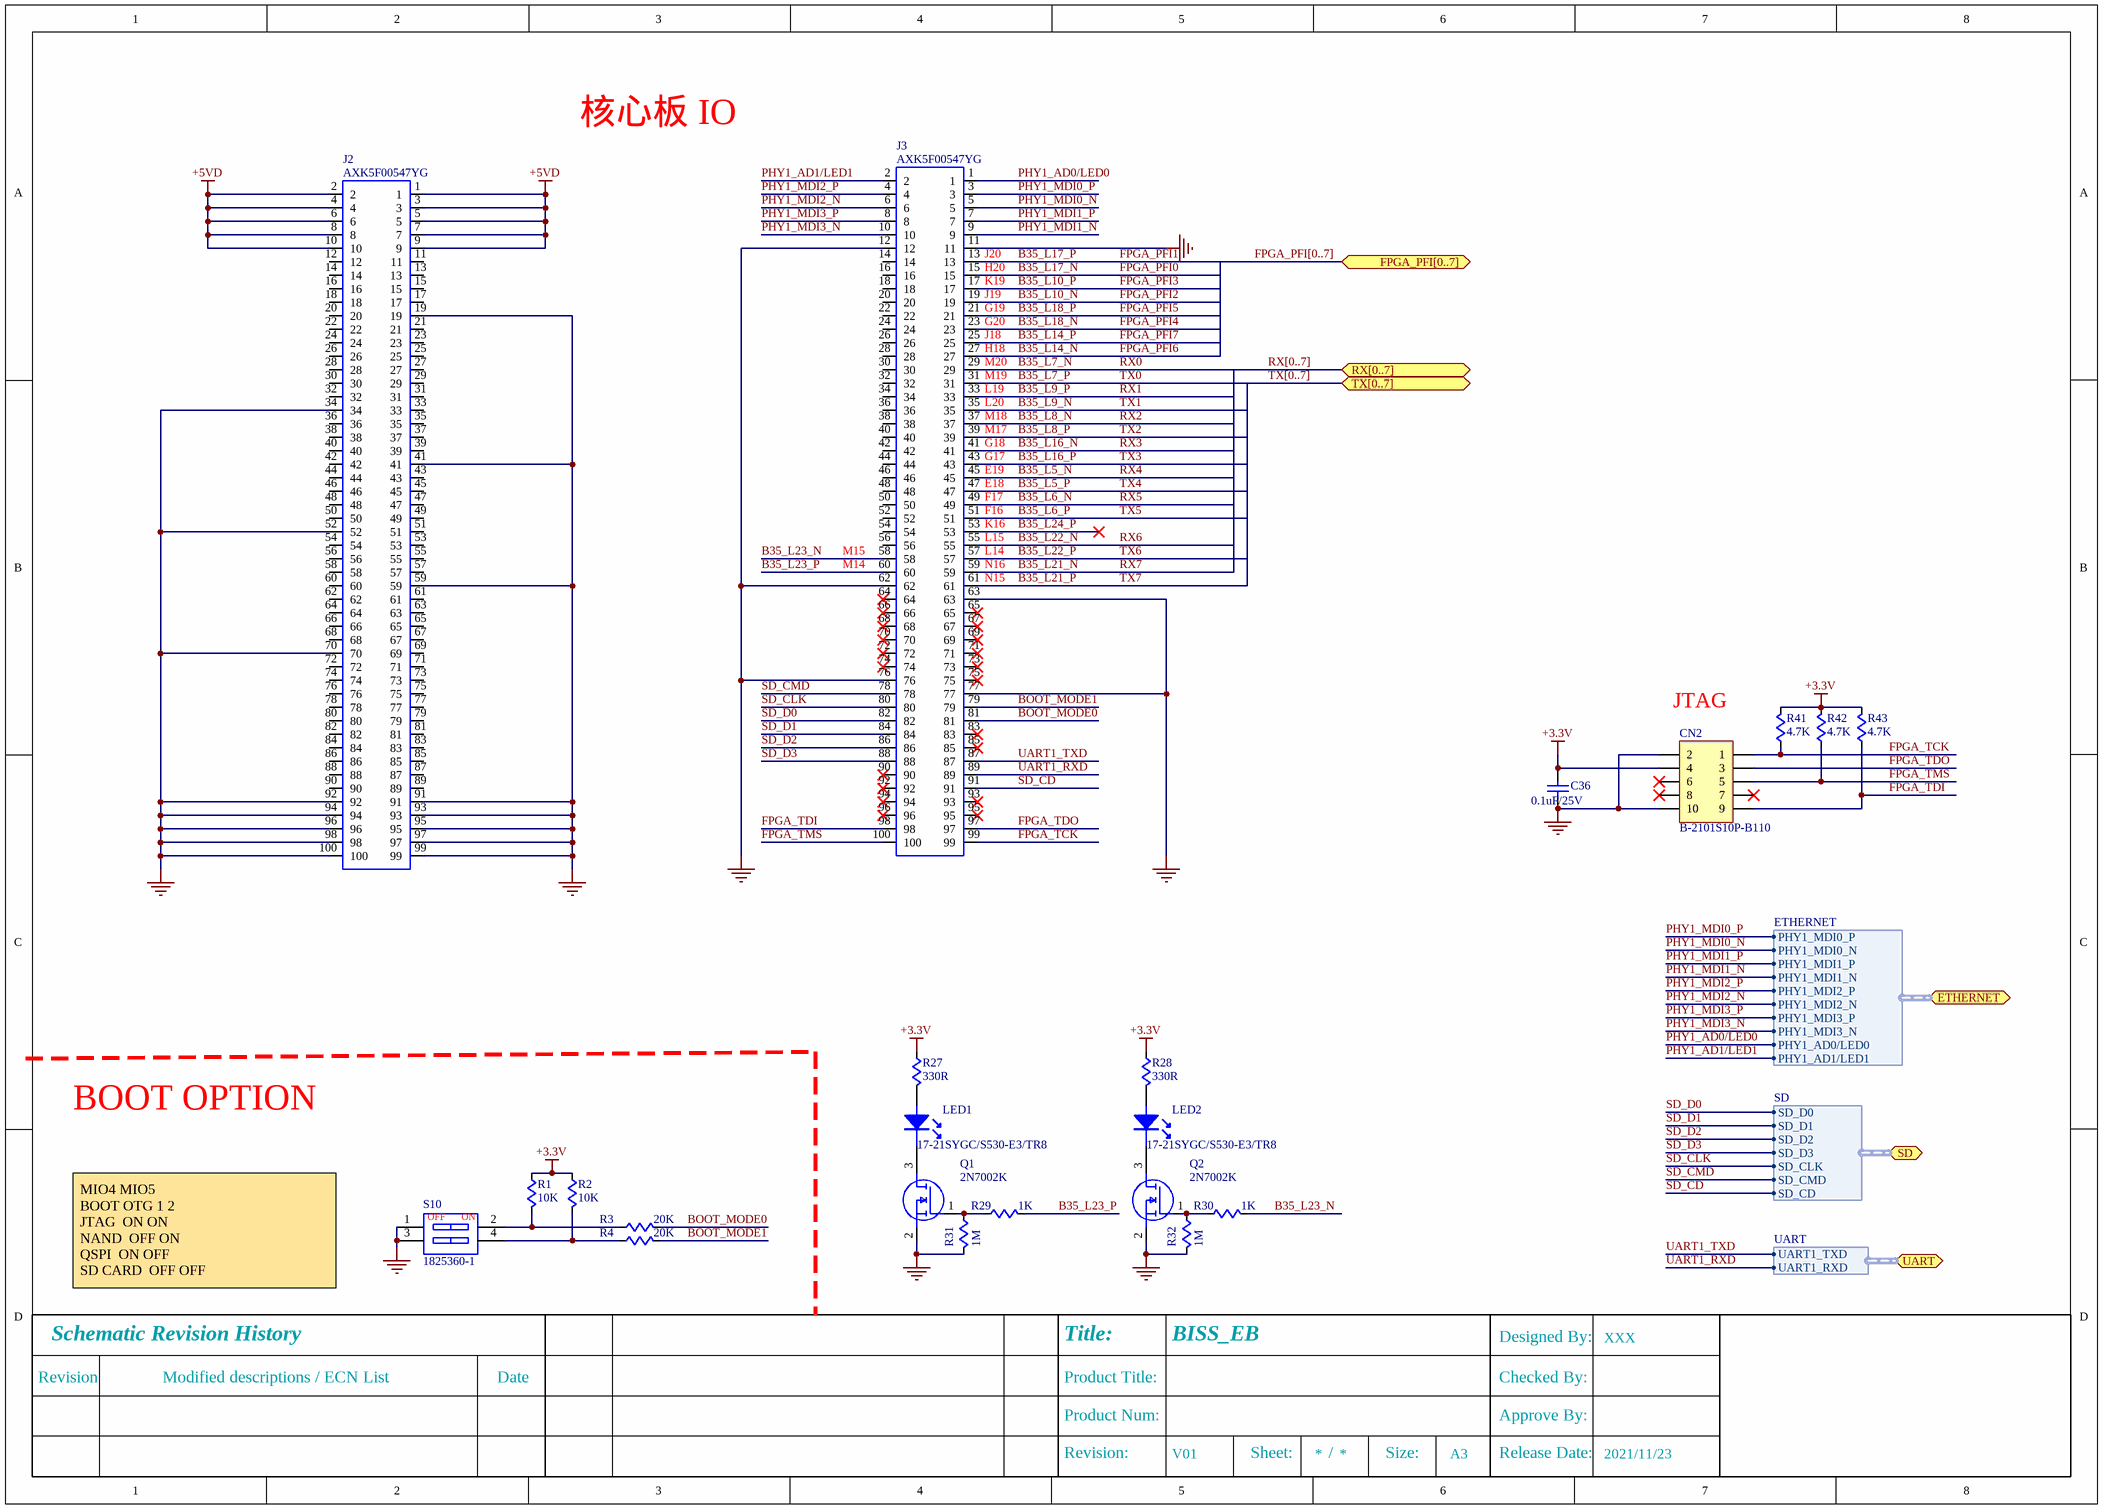
[diagram p5: 02_IO.SchDoc]

### Parts
C36  0.1uF/25V  [C0603]
CN2  B-2101S10P-B110  [SHF10501FDTH]
J2  AXK5F00547YG  [AXK5F00547YG]
J3  AXK5F00547YG  [AXK5F00547YG]
LED1  17-21SYGC/S530-E3/TR8  [LED_0805]
LED2  17-21SYGC/S530-E3/TR8  [LED_0805]
Q1  2N7002K  [SOT95P240X120-3N]
Q2  2N7002K  [SOT95P240X120-3N]
R1  10K  [R0603]
R2  10K  [R0603]
R3  20K  [R0603]
R4  20K  [R0603]
R27  330R  [R0603]
R28  330R  [R0603]
R29  1K  [R0603]
R30  1K  [R0603]
R31  1M  [R0603]
R32  1M  [R0603]
R41  4.7K  [R0603]
R42  4.7K  [R0603]
R43  4.7K  [R0603]
S10  1825360-1  [18253601]

### Ports
ETHERNET (bidir, harness ETHERNET), FPGA_PFI[0..7] (bidir), RX[0..7] (bidir), SD (bidir, harness SD), TX[0..7] (bidir), UART (bidir, harness UART)

### Harnesses
SD: SD_D0, SD_D1, SD_D2, SD_D3, SD_CLK, SD_CMD, SD_CD
UART: UART1_TXD, UART1_RXD
ETHERNET: PHY1_MDI0_P, PHY1_MDI0_N, PHY1_MDI1_P, PHY1_MDI1_N, PHY1_MDI2_P, PHY1_MDI2_N, PHY1_MDI3_P, PHY1_MDI3_N, PHY1_AD0/LED0, PHY1_AD1/LED1

### Nets
+3.3V: C36.1 CN2.4 R1.1 R2.1 R27.1 R28.1 R41.2 R42.2 R43.2
+5VD: J2.1 J2.2 J2.3 J2.4 J2.5 J2.6 J2.7 J2.8 J2.9 J2.10
GND: C36.2 CN2.2 CN2.10 J2.19 J2.34 J2.41 J2.52 J2.59 J2.70 J2.91 J2.92 J2.93 J2.94 J2.95 J2.96 J2.97 J2.98 J2.99 J2.100 J3.11 J3.12 J3.62 J3.63 J3.76 J3.77 Q1.2(S) Q2.2(S) R31.2 R32.2 S10.1 S10.3
B35_L5_N: J3.45  [also labelled RX4]
B35_L5_P: J3.47  [also labelled TX4]
B35_L6_N: J3.49  [also labelled RX5]
B35_L6_P: J3.51  [also labelled TX5]
B35_L7_N: J3.29  [also labelled RX0]
B35_L7_P: J3.31  [also labelled TX0]
B35_L8_N: J3.37  [also labelled RX2]
B35_L8_P: J3.39  [also labelled TX2]
B35_L9_N: J3.35  [also labelled TX1]
B35_L9_P: J3.33  [also labelled RX1]
B35_L10_N: J3.19  [also labelled FPGA_PFI2]
B35_L10_P: J3.17  [also labelled FPGA_PFI3]
B35_L14_N: J3.27  [also labelled FPGA_PFI6]
B35_L14_P: J3.25  [also labelled FPGA_PFI7]
B35_L16_N: J3.41  [also labelled RX3]
B35_L16_P: J3.43  [also labelled TX3]
B35_L17_N: J3.15  [also labelled FPGA_PFI0]
B35_L17_P: J3.13  [also labelled FPGA_PFI1]
B35_L18_N: J3.23  [also labelled FPGA_PFI4]
B35_L18_P: J3.21  [also labelled FPGA_PFI5]
B35_L21_N: J3.59  [also labelled RX7]
B35_L21_P: J3.61  [also labelled TX7]
B35_L22_N: J3.55  [also labelled RX6]
B35_L22_P: J3.57  [also labelled TX6]
B35_L23_N: J3.58 R30.2
B35_L23_P: J3.60 R29.2
B35_L24_P: J3.53
BOOT_MODE0: J3.81 R3.2
BOOT_MODE1: J3.79 R4.2
FPGA_TCK: CN2.1 J3.99 R41.1
FPGA_TDI: CN2.9 J3.98 R43.1
FPGA_TDO: CN2.3 J3.97
FPGA_TMS: CN2.5 J3.100 R42.1
PHY1_AD0/LED0: J3.1 ; port ETHERNET.PHY1_AD0/LED0
PHY1_AD1/LED1: J3.2 ; port ETHERNET.PHY1_AD1/LED1
PHY1_MDI0_N: J3.5 ; port ETHERNET.PHY1_MDI0_N
PHY1_MDI0_P: J3.3 ; port ETHERNET.PHY1_MDI0_P
PHY1_MDI1_N: J3.9 ; port ETHERNET.PHY1_MDI1_N
PHY1_MDI1_P: J3.7 ; port ETHERNET.PHY1_MDI1_P
PHY1_MDI2_N: J3.6 ; port ETHERNET.PHY1_MDI2_N
PHY1_MDI2_P: J3.4 ; port ETHERNET.PHY1_MDI2_P
PHY1_MDI3_N: J3.10 ; port ETHERNET.PHY1_MDI3_N
PHY1_MDI3_P: J3.8 ; port ETHERNET.PHY1_MDI3_P
SD_CD: J3.91 ; port SD.SD_CD
SD_CLK: J3.80 ; port SD.SD_CLK
SD_CMD: J3.78 ; port SD.SD_CMD
SD_D0: J3.82 ; port SD.SD_D0
SD_D1: J3.84 ; port SD.SD_D1
SD_D2: J3.86 ; port SD.SD_D2
SD_D3: J3.88 ; port SD.SD_D3
UART1_RXD: J3.89 ; port UART.UART1_RXD
UART1_TXD: J3.87 ; port UART.UART1_TXD
NetLED1_A: LED1.A R27.2
NetLED1_K: LED1.K Q1.3(D)
NetLED2_A: LED2.A R28.2
NetLED2_K: LED2.K Q2.3(D)
NetQ1_1: Q1.1(G) R29.1 R31.1
NetQ2_1: Q2.1(G) R30.1 R32.1
NetR1_2: R1.2 R3.1 S10.2
NetR2_2: R2.2 R4.1 S10.4

Not connected (* = marked no-connect by the designer): CN2 6* 7* 8*; J2 11 12 13 14 15 16 17 18 20 21 22 23 24 25 26 27 28 29 30 31 32 33 35 36 37 38 39 40 42 43 44 45 46 47 48 49 50 51 53 54 55 56 57 58 60 61 62 63 64 65 66 67 68 69 71 72 73 74 75 76 77 78 79 80 81 82 83 84 85 86 87 88 89 90; J3 14 16 18 20 22 24 26 28 30 32 34 36 38 40 42 44 46 48 50 52 54 56 64* 65* 66* 67* 68* 69* 70* 71* 72* 73* 74* 75* 83* 85* 90* 92* 93* 94* 95* 96*

### Buses and harness runs
bus FPGA_PFI[0..7] = port FPGA_PFI[0..7]
bus RX[0..7] = port RX[0..7]
bus TX[0..7] = port TX[0..7]

### Notes on the sheet
- 核心板 IO
- (near J3) G19
- (near J3) J19
- (near J3) J20
- (near J3) H20
- (near J3) K19
- (near J3) M19
- (near J3) M20
- (near J3) H18
- (near J3) J18
- (near J3) G20
- (near J3) G18
- (near J3) M17
- (near J3) M18
- (near J3) L20
- (near J3) L19
- (near J3) F16
- (near J3) F17
- (near J3) E18
- (near J3) E19
- (near J3) G17
- (near J3) M15
- (near J3) M14
- (near J3) N15
- (near J3) N16
- (near J3) L14
- (near J3) L15
- (near J3) K16
- JTAG
- BOOT OPTION
- MIO4	MIO5
  BOOT OTG	1	2
  JTAG		ON	ON
  NAND		OFF	ON
  QSPI		ON	OFF
  SD CARD		OFF	OFF
- Revision
- Schematic Revision History
- Modified descriptions / ECN List
- Date
- Product Title:
- Title:
- Checked By:
- Designed By:
- Revision:
- Product Num:
- Sheet:
- /
- Size:
- A3
- Approve By:
- Release Date:
- Title
- Date:
- Number:
- Time:
- Sheet
- of
- File:
- (in symbol 1825360-1) OFF; ON

### Library data of the parts
C36 = C: MLCC
CN2 = Header 5X2: 5*2P接插件,间距1.27mm,参考链接：https://so.szlcsc.com/global.html?k=B-2101S10P-B110&hot-key=LM358; 版权归属: 源创客; BOM名称: 5*2P接插件; 学习资源: www.ooocke.com
J2 J3 = Header_2X50: Header_2X50_0.5mm; PCB Footprint: H0_8X2X50_B
LED1 LED2 = LED: U_TABLE: U_113
Q1 Q2 = 2N7002K: MOSFET (N-Channel); Manufacturer_Name: onsemi; Datasheet Link: https://componentsearchengine.com/Datasheets/2/2N7002K.pdf; Height: 1.2mm; Manufacturer_Part_Number: 2N7002K; Mouser Part Number: 512-2N7002K; Mouser Price/Stock: https://www.mouser.co.uk/ProductDetail/onsemi-Fairchild/2N7002K?qs=iS%252BvaFGfLorx0keKeEIrfg%3D%3D; Arrow Part Number: 2N7002K; Arrow Price/Stock: https://www.arrow.com/en/products/2n7002k/on-semiconductor?region=europe
R1-R4 R27-R32 R41-R43 = R: 贴片电阻
S10 = 1825360-1: Switch; Manufacturer_Name: TE Connectivity; Datasheet Link: https://www.te.com/commerce/DocumentDelivery/DDEController?Action=srchrtrv&DocNm=1825360&DocType=CD&DocLang=EN; Height: 5.8mm; Manufacturer_Part_Number: 1825360-1; Mouser Part Number: 655-1825360-1; Mouser Price/Stock: https://www.mouser.co.uk/ProductDetail/TE-Connectivity-PB/1825360-1?qs=Ftb%252BnBCDTZKCT4kLG1kHfw%3D%3D; Arrow Part Number: 1825360-1; Arrow Price/Stock: https://www.arrow.com/en/products/1825360-1/te-connectivity

## Sheet 04_PS.SchDoc
size A3
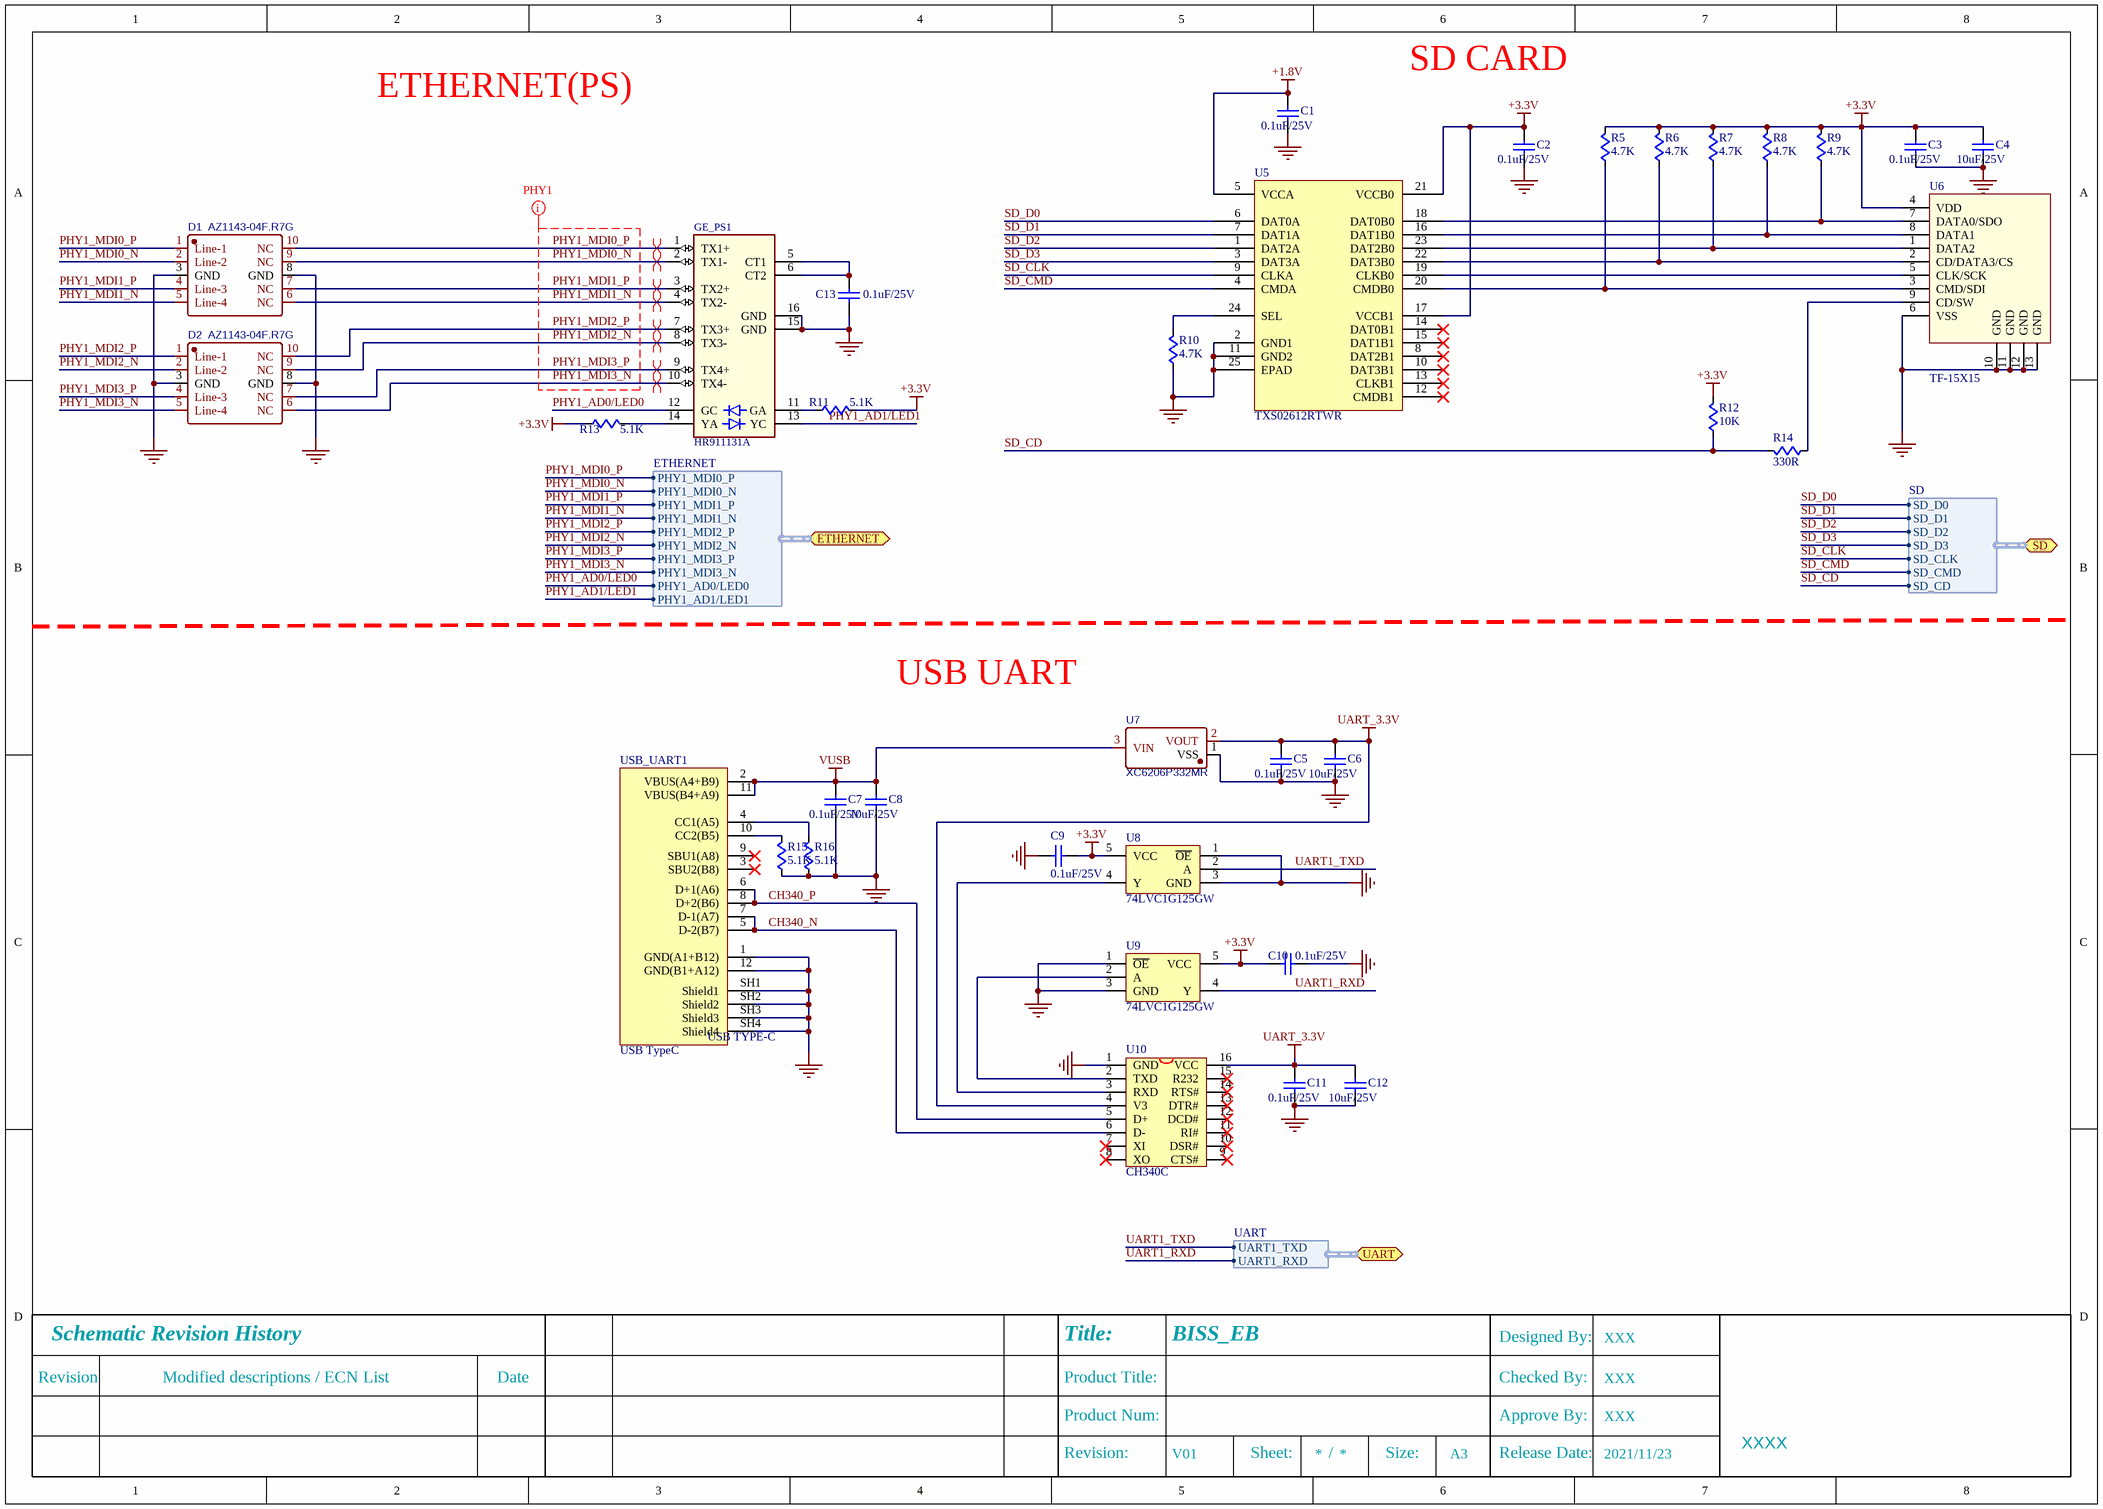
[diagram p6: 04_PS.SchDoc]

### Parts
(Parts that share a designator on the sheet are numbered #1, #2 ... from top to bottom, then left to right.)
C1  0.1uF/25V  [C0603]
C2  0.1uF/25V  [C0603]
C3  0.1uF/25V  [C0603]
C4  10uF/25V  [C1206]
C5  0.1uF/25V  [C0603]
C6  10uF/25V  [C1206]
C7  0.1uF/25V  [C0603]
C8  10uF/25V  [C1206]
C9  0.1uF/25V  [C0603]
C10  0.1uF/25V  [C0603]
C11  0.1uF/25V  [C0603]
C12  10uF/25V  [C1206]
C13  0.1uF/25V  [0603C]
D1  AZ1143-04F.R7G  [DFN2510P10E]
D2  AZ1143-04F.R7G  [DFN2510P10E]
GE_PS1  HR911131A  [HR911131A]
R5  4.7K  [R0603]
R6  4.7K  [R0603]
R7  4.7K  [R0603]
R8  4.7K  [R0603]
R9  4.7K  [R0603]
R10  4.7K  [R0603]
R11  5.1K  [R0603]
R12  10K  [R0603]
R13#2  5.1K  [R0603]
R14#2  330R  [R0603]
R15#2  5.1K  [R0603]
R16#2  5.1K  [R0603]
U5  TXS02612RTWR  [QFN24_RTW]
U6  TF-15X15  [Micro SD]
U7#2  XC6206P332MR  [SOT-23]
U8#2  74LVC1G125GW  [SOT353-L]
U9  74LVC1G125GW  [SOT353-L]
U10  CH340C  [SOP16M]
USB_UART1  USB TypeC  [USB Type-C]

### Ports
ETHERNET (bidir, harness ETHERNET), SD (bidir, harness SD), UART (bidir, harness UART)

### Harnesses
SD: SD_D0, SD_D1, SD_D2, SD_D3, SD_CLK, SD_CMD, SD_CD
UART: UART1_TXD, UART1_RXD
ETHERNET: PHY1_MDI0_P, PHY1_MDI0_N, PHY1_MDI1_P, PHY1_MDI1_N, PHY1_MDI2_P, PHY1_MDI2_N, PHY1_MDI3_P, PHY1_MDI3_N, PHY1_AD0/LED0, PHY1_AD1/LED1

### Nets
+1.8V: C1.1 U5.5(VCCA)
+3.3V: C2.1 C3.1 C4.1 C9.2 C10.1 R5.2 R6.2 R7.2 R8.2 R9.2 R11.2 R12.2 R13#2.1 U5.17(VCCB1) U5.21(VCCB0) U6.4(VDD) U8#2.5(VCC) U9.5(VCC)
GND: C1.2 C2.2 C3.2 C4.2 C5.2 C6.2 C7.2 C8.2 C9.1 C10.2 C11.2 C12.2 C13.1 D1.3(GND) D1.8(GND) D2.3(GND) D2.8(GND) GE_PS1.15(GND) GE_PS1.16(GND) R10.1 R15#2.1 R16#2.1 U5.2(GND1) U5.11(GND2) U5.25(EPAD) U6.6(VSS) U6.10(GND) U6.11(GND) U6.12(GND) U6.13(GND) U7#2.1(VSS) U8#2.1(~{OE}) U8#2.3(GND) U9.1(~{OE}) U9.3(GND) U10.1(GND) USB_UART1.1(GND(A1+B12)) USB_UART1.12(GND(B1+A12)) USB_UART1.SH1(Shield1) USB_UART1.SH2(Shield2) USB_UART1.SH3(Shield3) USB_UART1.SH4(Shield4)
UART_3.3V: C5.1 C6.1 C11.1 C12.1 U7#2.2(VOUT) U10.4(V3) U10.16(VCC)
VUSB: C7.1 C8.1 U7#2.3(VIN) USB_UART1.2(VBUS(A4+B9)) USB_UART1.11(VBUS(B4+A9))
CH340_N: U10.6(D-) USB_UART1.5(D-2(B7)) USB_UART1.7(D-1(A7))
CH340_P: U10.5(D+) USB_UART1.6(D+1(A6)) USB_UART1.8(D+2(B6))
PHY1_AD0/LED0: GE_PS1.12(GC) ; port ETHERNET.PHY1_AD0/LED0
PHY1_AD1/LED1: GE_PS1.13(YC) ; port ETHERNET.PHY1_AD1/LED1
PHY1_MDI0_N: D1.2(Line-2) D1.9(NC) GE_PS1.2(TX1-) ; port ETHERNET.PHY1_MDI0_N
PHY1_MDI0_P: D1.1(Line-1) D1.10(NC) GE_PS1.1(TX1+) ; port ETHERNET.PHY1_MDI0_P
PHY1_MDI1_N: D1.5(Line-4) D1.6(NC) GE_PS1.4(TX2-) ; port ETHERNET.PHY1_MDI1_N
PHY1_MDI1_P: D1.4(Line-3) D1.7(NC) GE_PS1.3(TX2+) ; port ETHERNET.PHY1_MDI1_P
PHY1_MDI2_N: D2.2(Line-2) D2.9(NC) GE_PS1.8(TX3-) ; port ETHERNET.PHY1_MDI2_N
PHY1_MDI2_P: D2.1(Line-1) D2.10(NC) GE_PS1.7(TX3+) ; port ETHERNET.PHY1_MDI2_P
PHY1_MDI3_N: D2.5(Line-4) D2.6(NC) GE_PS1.10(TX4-) ; port ETHERNET.PHY1_MDI3_N
PHY1_MDI3_P: D2.4(Line-3) D2.7(NC) GE_PS1.9(TX4+) ; port ETHERNET.PHY1_MDI3_P
SD_CD: R12.1 R14#2.2 ; port SD.SD_CD
SD_CLK: U5.9(CLKA) ; port SD.SD_CLK
SD_CMD: U5.4(CMDA) ; port SD.SD_CMD
SD_D0: U5.6(DAT0A) ; port SD.SD_D0
SD_D1: U5.7(DAT1A) ; port SD.SD_D1
SD_D2: U5.1(DAT2A) ; port SD.SD_D2
SD_D3: U5.3(DAT3A) ; port SD.SD_D3
UART1_RXD: U9.4(Y) ; port UART.UART1_RXD
UART1_TXD: U8#2.2(A) ; port UART.UART1_TXD
NetC13_2: C13.2 GE_PS1.5(CT1) GE_PS1.6(CT2)
NetGE_PS1_11: GE_PS1.11(GA) R11.1
NetGE_PS1_14: GE_PS1.14(YA) R13#2.2
NetR5_1: R5.1 U5.20(CMDB0) U6.3(CMD/SDI)
NetR6_1: R6.1 U5.22(DAT3B0) U6.2(CD/DATA3/CS)
NetR7_1: R7.1 U5.23(DAT2B0) U6.1(DATA2)
NetR8_1: R8.1 U5.16(DAT1B0) U6.8(DATA1)
NetR9_1: R9.1 U5.18(DAT0B0) U6.7(DATA0/SDO)
NetR10_2: R10.2 U5.24(SEL)
NetR14#2_1: R14#2.1 U6.9(CD/SW)
NetR15#2_2: R15#2.2 USB_UART1.10(CC2(B5))
NetR16#2_2: R16#2.2 USB_UART1.4(CC1(A5))
NetU5_19: U5.19(CLKB0) U6.5(CLK/SCK)
NetU8#2_4: U8#2.4(Y) U10.3(RXD)
NetU9_2: U9.2(A) U10.2(TXD)

Not connected (* = marked no-connect by the designer): U5 8(DAT2B1)* 10(DAT3B1)* 12(CMDB1)* 13(CLKB1)* 14(DAT0B1)* 15(DAT1B1)*; U10 7(XI)* 8(XO)* 9(CTS#)* 10(DSR#)* 11(RI#)* 12(DCD#)* 13(DTR#)* 14(RTS#)* 15(R232)*; USB_UART1 3(SBU2(B8))* 9(SBU1(A8))*

### Layout directives
differential pair: PHY1_MDI0_N, PHY1_MDI0_P, PHY1_MDI1_N, PHY1_MDI1_P, PHY1_MDI2_N, PHY1_MDI2_P, PHY1_MDI3_N, PHY1_MDI3_P
net class PHY1: PHY1_MDI0_N, PHY1_MDI0_P, PHY1_MDI1_N, PHY1_MDI1_P, PHY1_MDI2_N, PHY1_MDI2_P, PHY1_MDI3_N, PHY1_MDI3_P

### Notes on the sheet
- ETHERNET(PS)
- SD CARD
- USB UART
- Revision
- Schematic Revision History
- Modified descriptions / ECN List
- Date
- Product Title:
- Title:
- Checked By:
- Designed By:
- Revision:
- Product Num:
- Sheet:
- /
- Size:
- A3
- Approve By:
- Release Date:
- XXXX
- Title
- Date:
- Number:
- Time:
- Sheet
- of
- File:
- (in symbol USB Type-C) USB TYPE-C

### Library data of the parts
C1-C12 = C: MLCC
C13 = Cap Semi: X7R/C0G贴片电容; Value: 0.1uF; 1-物料编码: 150203068; 1-物料描述: SMT电容0402_X7R_100nF_25V_K_FengHua_EHRA
D1 D2 = AZ1045-04F.R7G: ESD芯片，台舟电子，TPAZ1143-04F; BOM_Manufacturer: AMAZING; Contributor: LCSC; BOM_Supplier: LCSC; BOM_Supplier Part: C356811; BOM_Manufacturer Part: AZ1045-04F.R7G; spicePre: D; spiceSymbolName: AZ1045-04F.R7G
GE_PS1 = HR911131A/C: 千兆以太网接口
R5-R12 R13#2 R14#2 R15#2 R16#2 = R: 贴片电阻
U5 = TXS02612RTWR: 集成电路
U6 = Micro SD: Micro SD卡,硕方：TF-15X15; 版权归属: 源创客; BOM名称: Micro SD卡; 学习资源: www.ooocke.com
U7#2 = XC6206P332MR_C347376: 集成电路; BOM_Manufacturer: Youtai Semiconductor Co., Ltd.; Contributor: LCSC; SMT Type: Extend; BOM_Supplier: LCSC; BOM_Supplier Part: C347376; BOM_Manufacturer Part: XC6206P332MR; BOM_LCSC Assembly: Yes; spicePre: U; spiceSymbolName: XC6206P332MR_C347376
U8#2 U9 = 74LVC1G125GW: 1路 非反向三态缓冲器 低有效
U10 = CH340G: USB2UART
USB_UART1 = USB Type-C: 12P TypeC 母座，参考购买链接https://item.szlcsc.com/147739.html

## Nets that join several sheets
+1.8V: 01_DC_Power (5 pins), 04_PS (C1.1 U5.5)
+3.3V: 01_DC_Power (5 pins), 02_IO (9 pins), 04_PS (18 pins)
+5VA: 01_DC_Power (R17.2), 0 (C27_0.1 R25_0.1 R26_0.1 U4_0.16), 1 (C27_1.1 R25_1.1 R26_1.1 U4_1.16), 2 (C27_2.1 R25_2.1 R26_2.1 U4_2.16), 3 (C27_3.1 R25_3.1 R26_3.1 U4_3.16), 4 (C27_4.1 R25_4.1 R26_4.1 U4_4.16), 5 (C27_5.1 R25_5.1 R26_5.1 U4_5.16), 6 (C27_6.1 R25_6.1 R26_6.1 U4_6.16), 7 (C27_7.1 R25_7.1 R26_7.1 U4_7.16)
+5VD: 01_DC_Power (9 pins), 03_AI_PFI_Connector (R23.2), 06_PFI_Buffer (8 pins), 02_IO (10 pins)
GND: 01_DC_Power (16 pins), 03_AI_PFI_Connector (22 pins), 06_PFI_Buffer (12 pins), 0 (9 pins), 1 (9 pins), 2 (9 pins), 3 (9 pins), 4 (9 pins), 5 (9 pins), 6 (9 pins), 7 (9 pins), 02_IO (31 pins), 04_PS (42 pins)
VDDIO_A: 01_DC_Power (R21.2 R22.2), 06_PFI_Buffer (12 pins), 0 (C26_0.1 U4_0.1), 1 (C26_1.1 U4_1.1), 2 (C26_2.1 U4_2.1), 3 (C26_3.1 U4_3.1), 4 (C26_4.1 U4_4.1), 5 (C26_5.1 U4_5.1), 6 (C26_6.1 U4_6.1), 7 (C26_7.1 U4_7.1)
A: 03_AI_PFI_Connector (J1.15), 0 (R25_0.2 R33_0.1 U4_0.14)
A: 03_AI_PFI_Connector (J1.18), 1 (R25_1.2 R33_1.1 U4_1.14)
A: 03_AI_PFI_Connector (J1.20), 2 (R25_2.2 R33_2.1 U4_2.14)
A: 03_AI_PFI_Connector (J1.23), 3 (R25_3.2 R33_3.1 U4_3.14)
A: 03_AI_PFI_Connector (J1.25), 4 (R25_4.2 R33_4.1 U4_4.14)
A: 03_AI_PFI_Connector (J1.28), 5 (R25_5.2 R33_5.1 U4_5.14)
A: 03_AI_PFI_Connector (J1.30), 6 (R25_6.2 R33_6.1 U4_6.14)
A: 03_AI_PFI_Connector (J1.33), 7 (R25_7.2 R33_7.1 U4_7.14)
B: 03_AI_PFI_Connector (J1.16), 0 (R33_0.2 R35_0.1 U4_0.13)
B: 03_AI_PFI_Connector (J1.19), 1 (R33_1.2 R35_1.1 U4_1.13)
B: 03_AI_PFI_Connector (J1.21), 2 (R33_2.2 R35_2.1 U4_2.13)
B: 03_AI_PFI_Connector (J1.24), 3 (R33_3.2 R35_3.1 U4_3.13)
B: 03_AI_PFI_Connector (J1.26), 4 (R33_4.2 R35_4.1 U4_4.13)
B: 03_AI_PFI_Connector (J1.29), 5 (R33_5.2 R35_5.1 U4_5.13)
B: 03_AI_PFI_Connector (J1.31), 6 (R33_6.2 R35_6.1 U4_6.13)
B: 03_AI_PFI_Connector (J1.34), 7 (R33_7.2 R35_7.1 U4_7.13)
B35_L5_N: 4 (U4_4.3), 02_IO (J3.45)
B35_L5_P: 4 (U4_4.6), 02_IO (J3.47)
B35_L6_N: 5 (U4_5.3), 02_IO (J3.49)
B35_L6_P: 5 (U4_5.6), 02_IO (J3.51)
B35_L7_N: 0 (U4_0.3), 02_IO (J3.29)
B35_L7_P: 0 (U4_0.6), 02_IO (J3.31)
B35_L8_N: 2 (U4_2.3), 02_IO (J3.37)
B35_L8_P: 2 (U4_2.6), 02_IO (J3.39)
B35_L9_N: 1 (U4_1.6), 02_IO (J3.35)
B35_L9_P: 1 (U4_1.3), 02_IO (J3.33)
B35_L10_N: 06_PFI_Buffer (U12.5), 02_IO (J3.19)
B35_L10_P: 06_PFI_Buffer (U12.4), 02_IO (J3.17)
B35_L14_N: 06_PFI_Buffer (U14.5), 02_IO (J3.27)
B35_L14_P: 06_PFI_Buffer (U14.4), 02_IO (J3.25)
B35_L16_N: 3 (U4_3.3), 02_IO (J3.41)
B35_L16_P: 3 (U4_3.6), 02_IO (J3.43)
B35_L17_N: 06_PFI_Buffer (U11.5), 02_IO (J3.15)
B35_L17_P: 06_PFI_Buffer (U11.4), 02_IO (J3.13)
B35_L18_N: 06_PFI_Buffer (U13.5), 02_IO (J3.23)
B35_L18_P: 06_PFI_Buffer (U13.4), 02_IO (J3.21)
B35_L21_N: 7 (U4_7.3), 02_IO (J3.59)
B35_L21_P: 7 (U4_7.6), 02_IO (J3.61)
B35_L22_N: 6 (U4_6.3), 02_IO (J3.55)
B35_L22_P: 6 (U4_6.6), 02_IO (J3.57)
PFI0: 03_AI_PFI_Connector (J1.8), 06_PFI_Buffer (U11.8)
PFI1: 03_AI_PFI_Connector (J1.6), 06_PFI_Buffer (U11.1)
PFI2: 03_AI_PFI_Connector (J1.4), 06_PFI_Buffer (U12.8)
PFI3: 03_AI_PFI_Connector (J1.2), 06_PFI_Buffer (U12.1)
PFI4: 03_AI_PFI_Connector (J1.37), 06_PFI_Buffer (U13.8)
PFI5: 03_AI_PFI_Connector (J1.39), 06_PFI_Buffer (U13.1)
PFI6: 03_AI_PFI_Connector (J1.41), 06_PFI_Buffer (U14.8)
PFI7: 03_AI_PFI_Connector (J1.43), 06_PFI_Buffer (U14.1)
PHY1_AD0/LED0: 02_IO (J3.1), 04_PS (GE_PS1.12)
PHY1_AD1/LED1: 02_IO (J3.2), 04_PS (GE_PS1.13)
PHY1_MDI0_N: 02_IO (J3.5), 04_PS (D1.2 D1.9 GE_PS1.2)
PHY1_MDI0_P: 02_IO (J3.3), 04_PS (D1.1 D1.10 GE_PS1.1)
PHY1_MDI1_N: 02_IO (J3.9), 04_PS (D1.5 D1.6 GE_PS1.4)
PHY1_MDI1_P: 02_IO (J3.7), 04_PS (D1.4 D1.7 GE_PS1.3)
PHY1_MDI2_N: 02_IO (J3.6), 04_PS (D2.2 D2.9 GE_PS1.8)
PHY1_MDI2_P: 02_IO (J3.4), 04_PS (D2.1 D2.10 GE_PS1.7)
PHY1_MDI3_N: 02_IO (J3.10), 04_PS (D2.5 D2.6 GE_PS1.10)
PHY1_MDI3_P: 02_IO (J3.8), 04_PS (D2.4 D2.7 GE_PS1.9)
SD_CD: 02_IO (J3.91), 04_PS (R12.1 R14#2.2)
SD_CLK: 02_IO (J3.80), 04_PS (U5.9)
SD_CMD: 02_IO (J3.78), 04_PS (U5.4)
SD_D0: 02_IO (J3.82), 04_PS (U5.6)
SD_D1: 02_IO (J3.84), 04_PS (U5.7)
SD_D2: 02_IO (J3.86), 04_PS (U5.1)
SD_D3: 02_IO (J3.88), 04_PS (U5.3)
UART1_RXD: 02_IO (J3.89), 04_PS (U9.4)
UART1_TXD: 02_IO (J3.87), 04_PS (U8#2.2)
Y: 03_AI_PFI_Connector (J1.50), 0 (R26_0.2 R34_0.1 U4_0.10)
Y: 03_AI_PFI_Connector (J1.53), 1 (R26_1.2 R34_1.1 U4_1.10)
Y: 03_AI_PFI_Connector (J1.55), 2 (R26_2.2 R34_2.1 U4_2.10)
Y: 03_AI_PFI_Connector (J1.58), 3 (R26_3.2 R34_3.1 U4_3.10)
Y: 03_AI_PFI_Connector (J1.60), 4 (R26_4.2 R34_4.1 U4_4.10)
Y: 03_AI_PFI_Connector (J1.63), 5 (R26_5.2 R34_5.1 U4_5.10)
Y: 03_AI_PFI_Connector (J1.65), 6 (R26_6.2 R34_6.1 U4_6.10)
Y: 03_AI_PFI_Connector (J1.68), 7 (R26_7.2 R34_7.1 U4_7.10)
Z: 03_AI_PFI_Connector (J1.49), 0 (R34_0.2 R36_0.1 U4_0.11)
Z: 03_AI_PFI_Connector (J1.52), 1 (R34_1.2 R36_1.1 U4_1.11)
Z: 03_AI_PFI_Connector (J1.54), 2 (R34_2.2 R36_2.1 U4_2.11)
Z: 03_AI_PFI_Connector (J1.57), 3 (R34_3.2 R36_3.1 U4_3.11)
Z: 03_AI_PFI_Connector (J1.59), 4 (R34_4.2 R36_4.1 U4_4.11)
Z: 03_AI_PFI_Connector (J1.62), 5 (R34_5.2 R36_5.1 U4_5.11)
Z: 03_AI_PFI_Connector (J1.64), 6 (R34_6.2 R36_6.1 U4_6.11)
Z: 03_AI_PFI_Connector (J1.67), 7 (R34_7.2 R36_7.1 U4_7.11)

## Assembly variants
V01: not fitted C14 C15 C16 C17 C18 C19 C20 C21 D4 L1 MARK1 MARK2 MARK3 MARK4 MARK5 MARK6 R13 R14 R15 R16 R21 R36_1 R36_2 R36_3 R36_4 R36_5 R36_6 R36_7 R36_8 R38_1 R38_2 R38_3 R38_4 R38_5 R38_6 R38_7 R38_8 R40_1 R40_2 R40_3 R40_4 R40_5 R40_6 R40_7 R40_8 U7 U8